# EAGLE board M865B (EAGLE 6.6.0), part 1 of 2
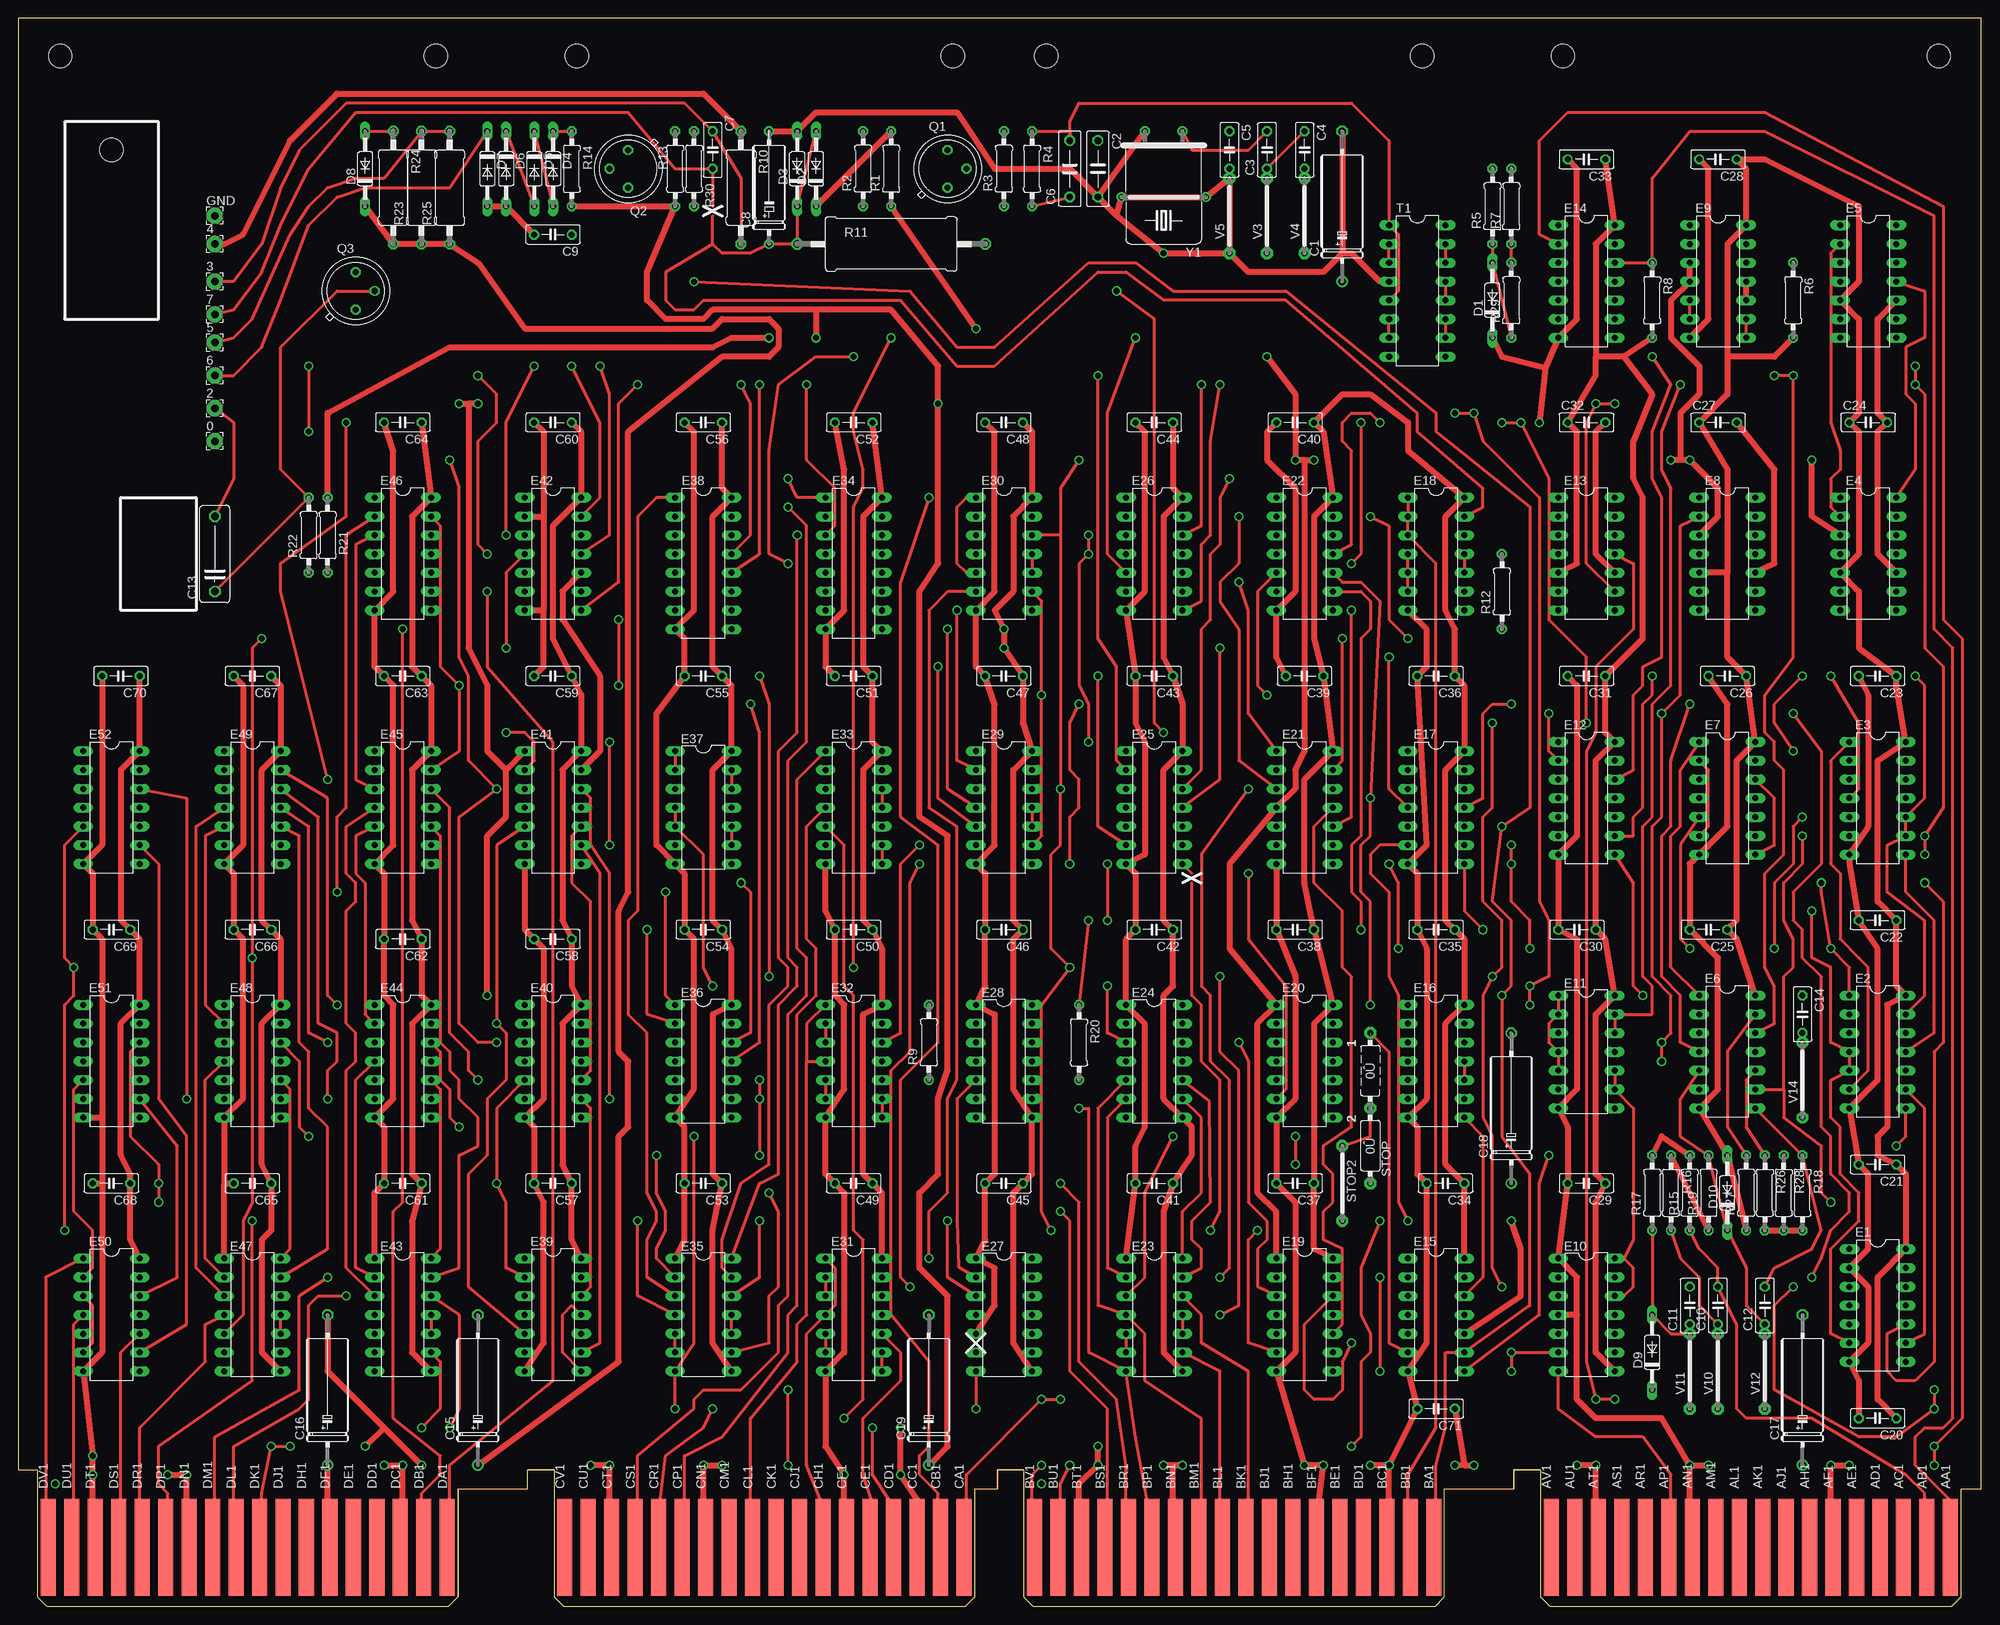
[diagram p2: board, top side]
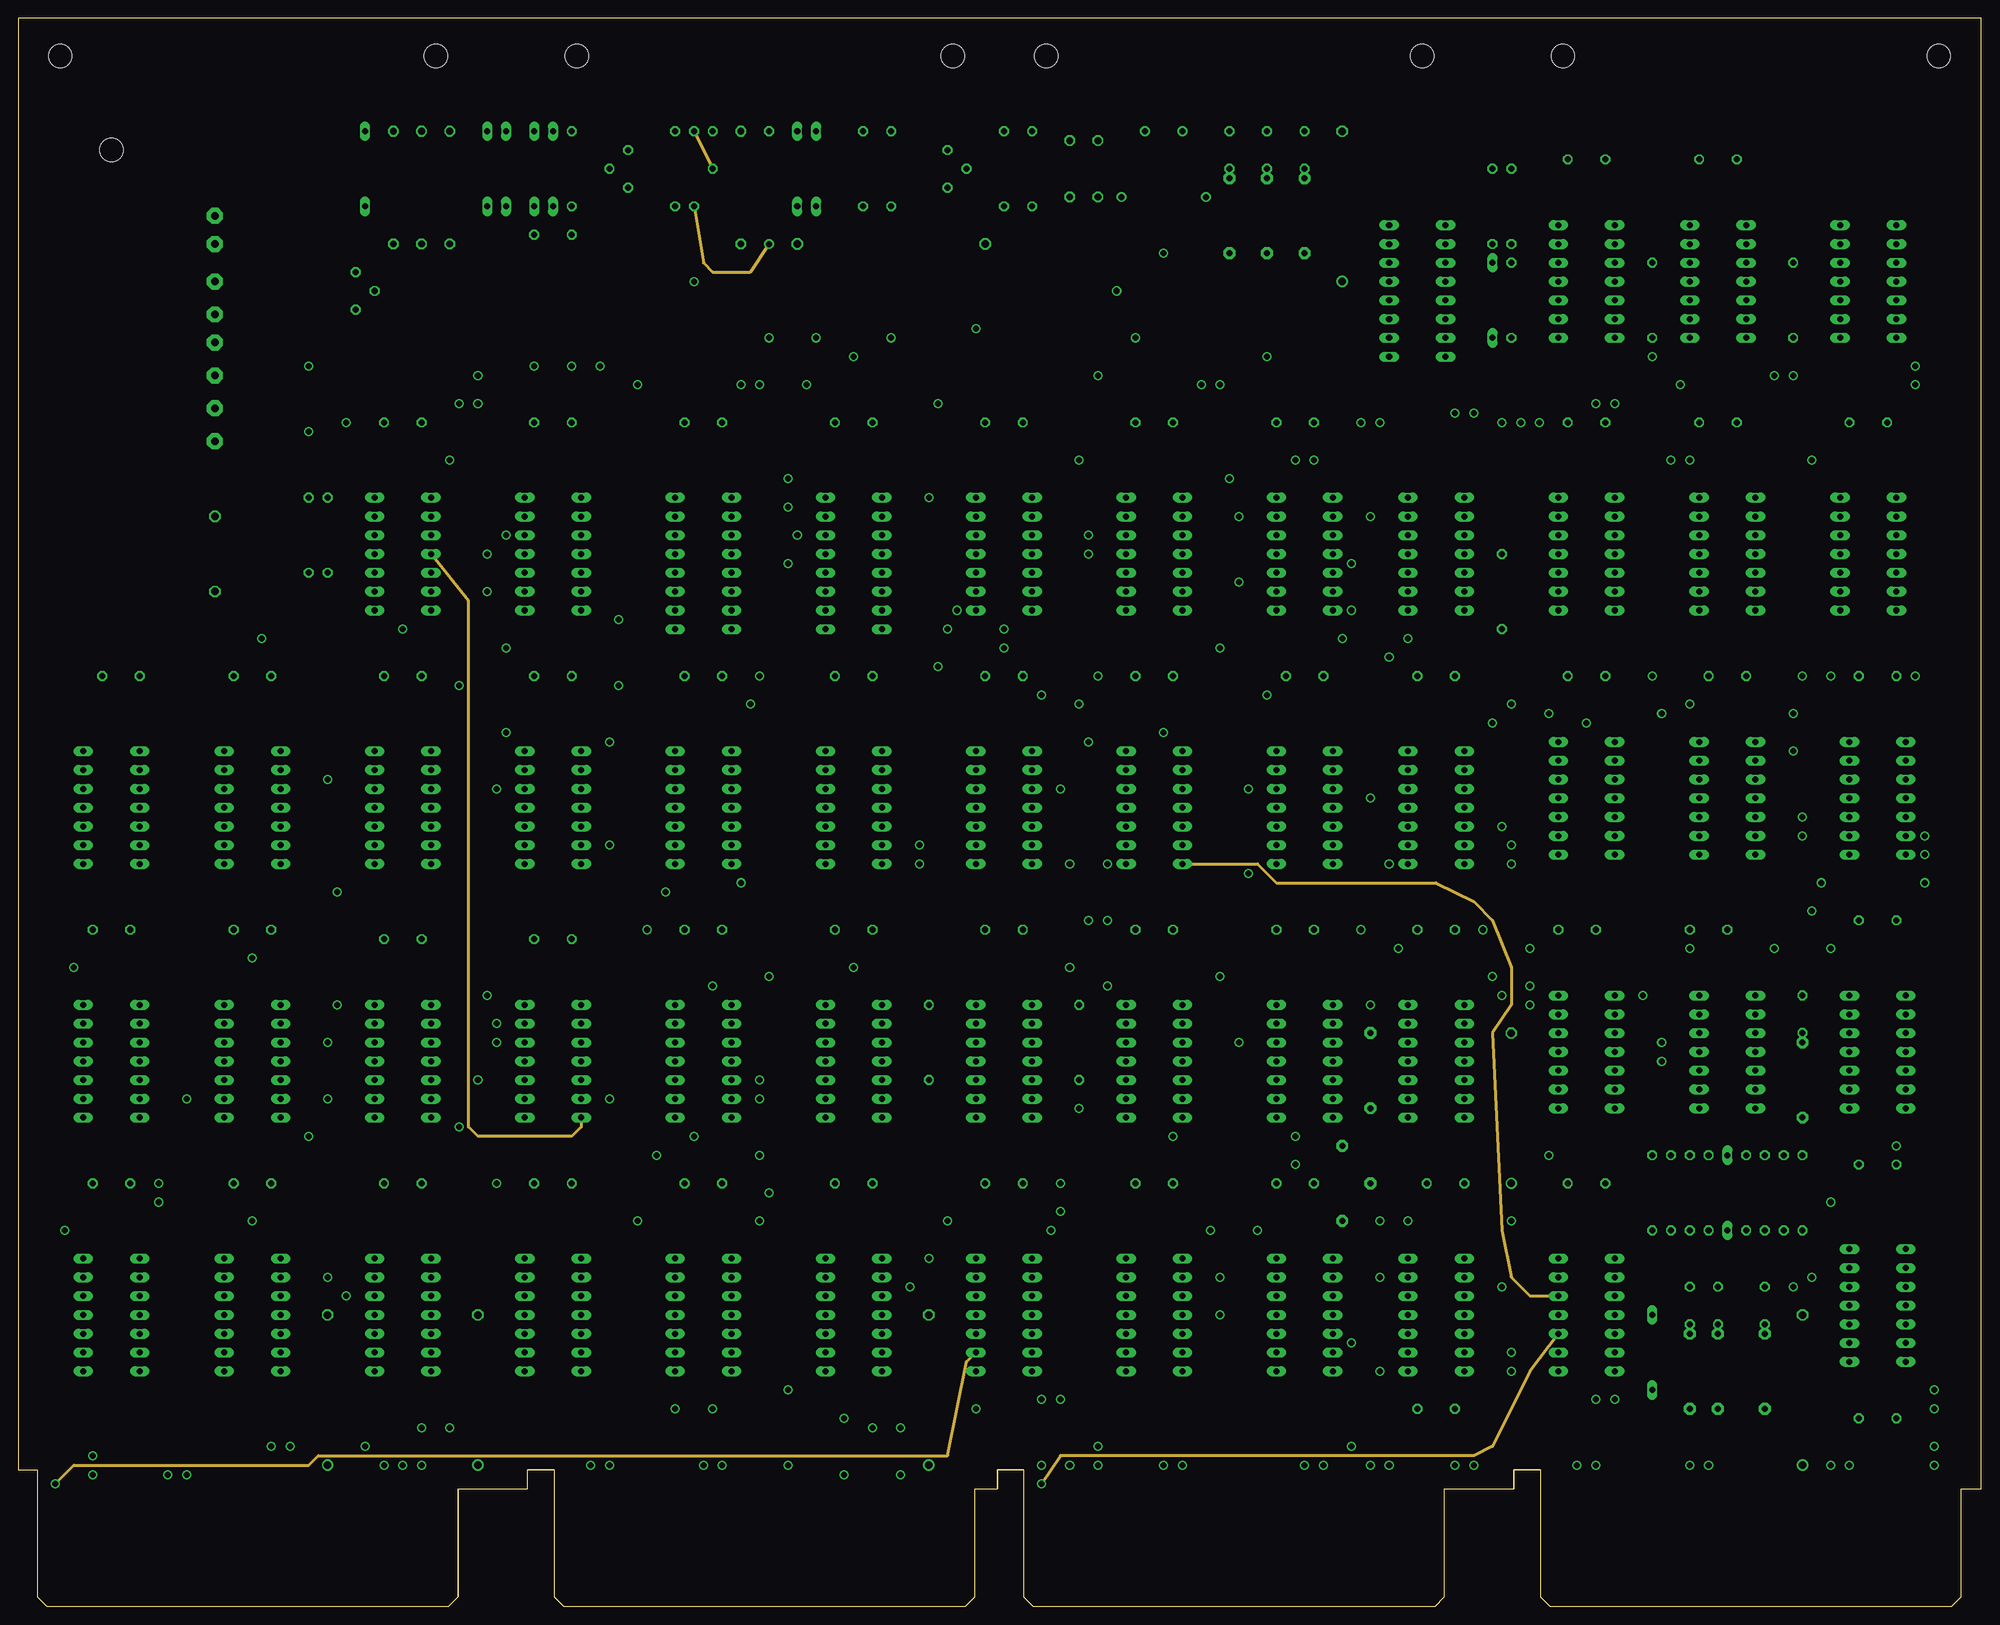
[diagram p3: board, inner layer ECO1]
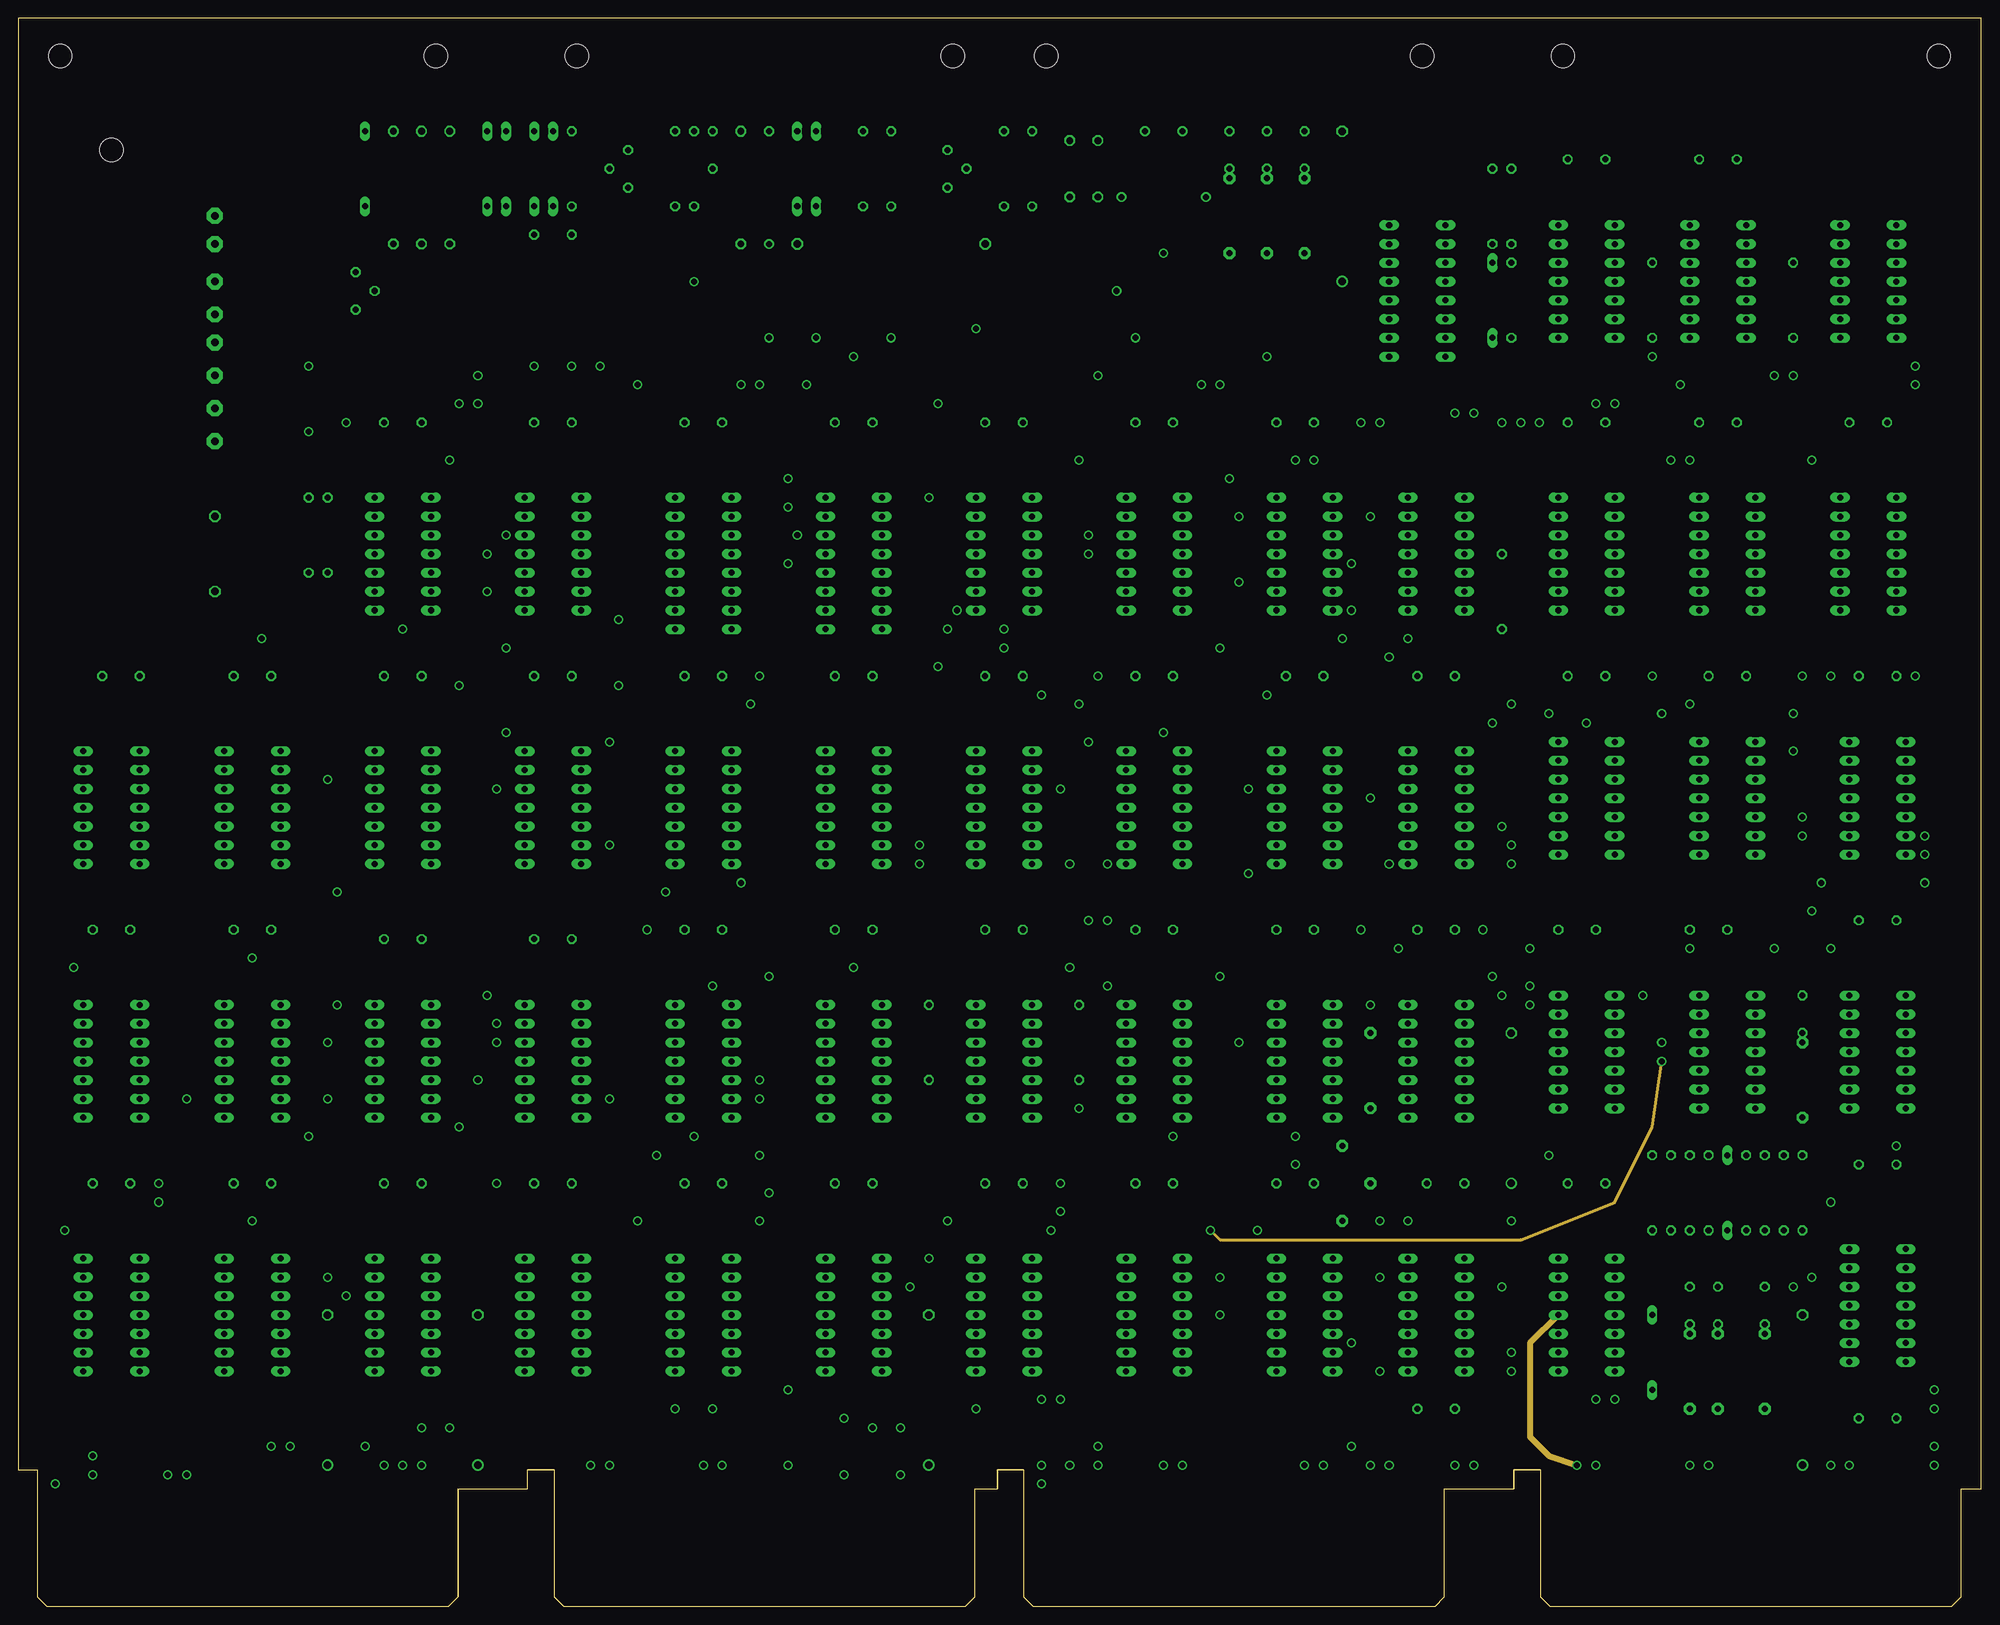
[diagram p4: board, inner layer ECO2]
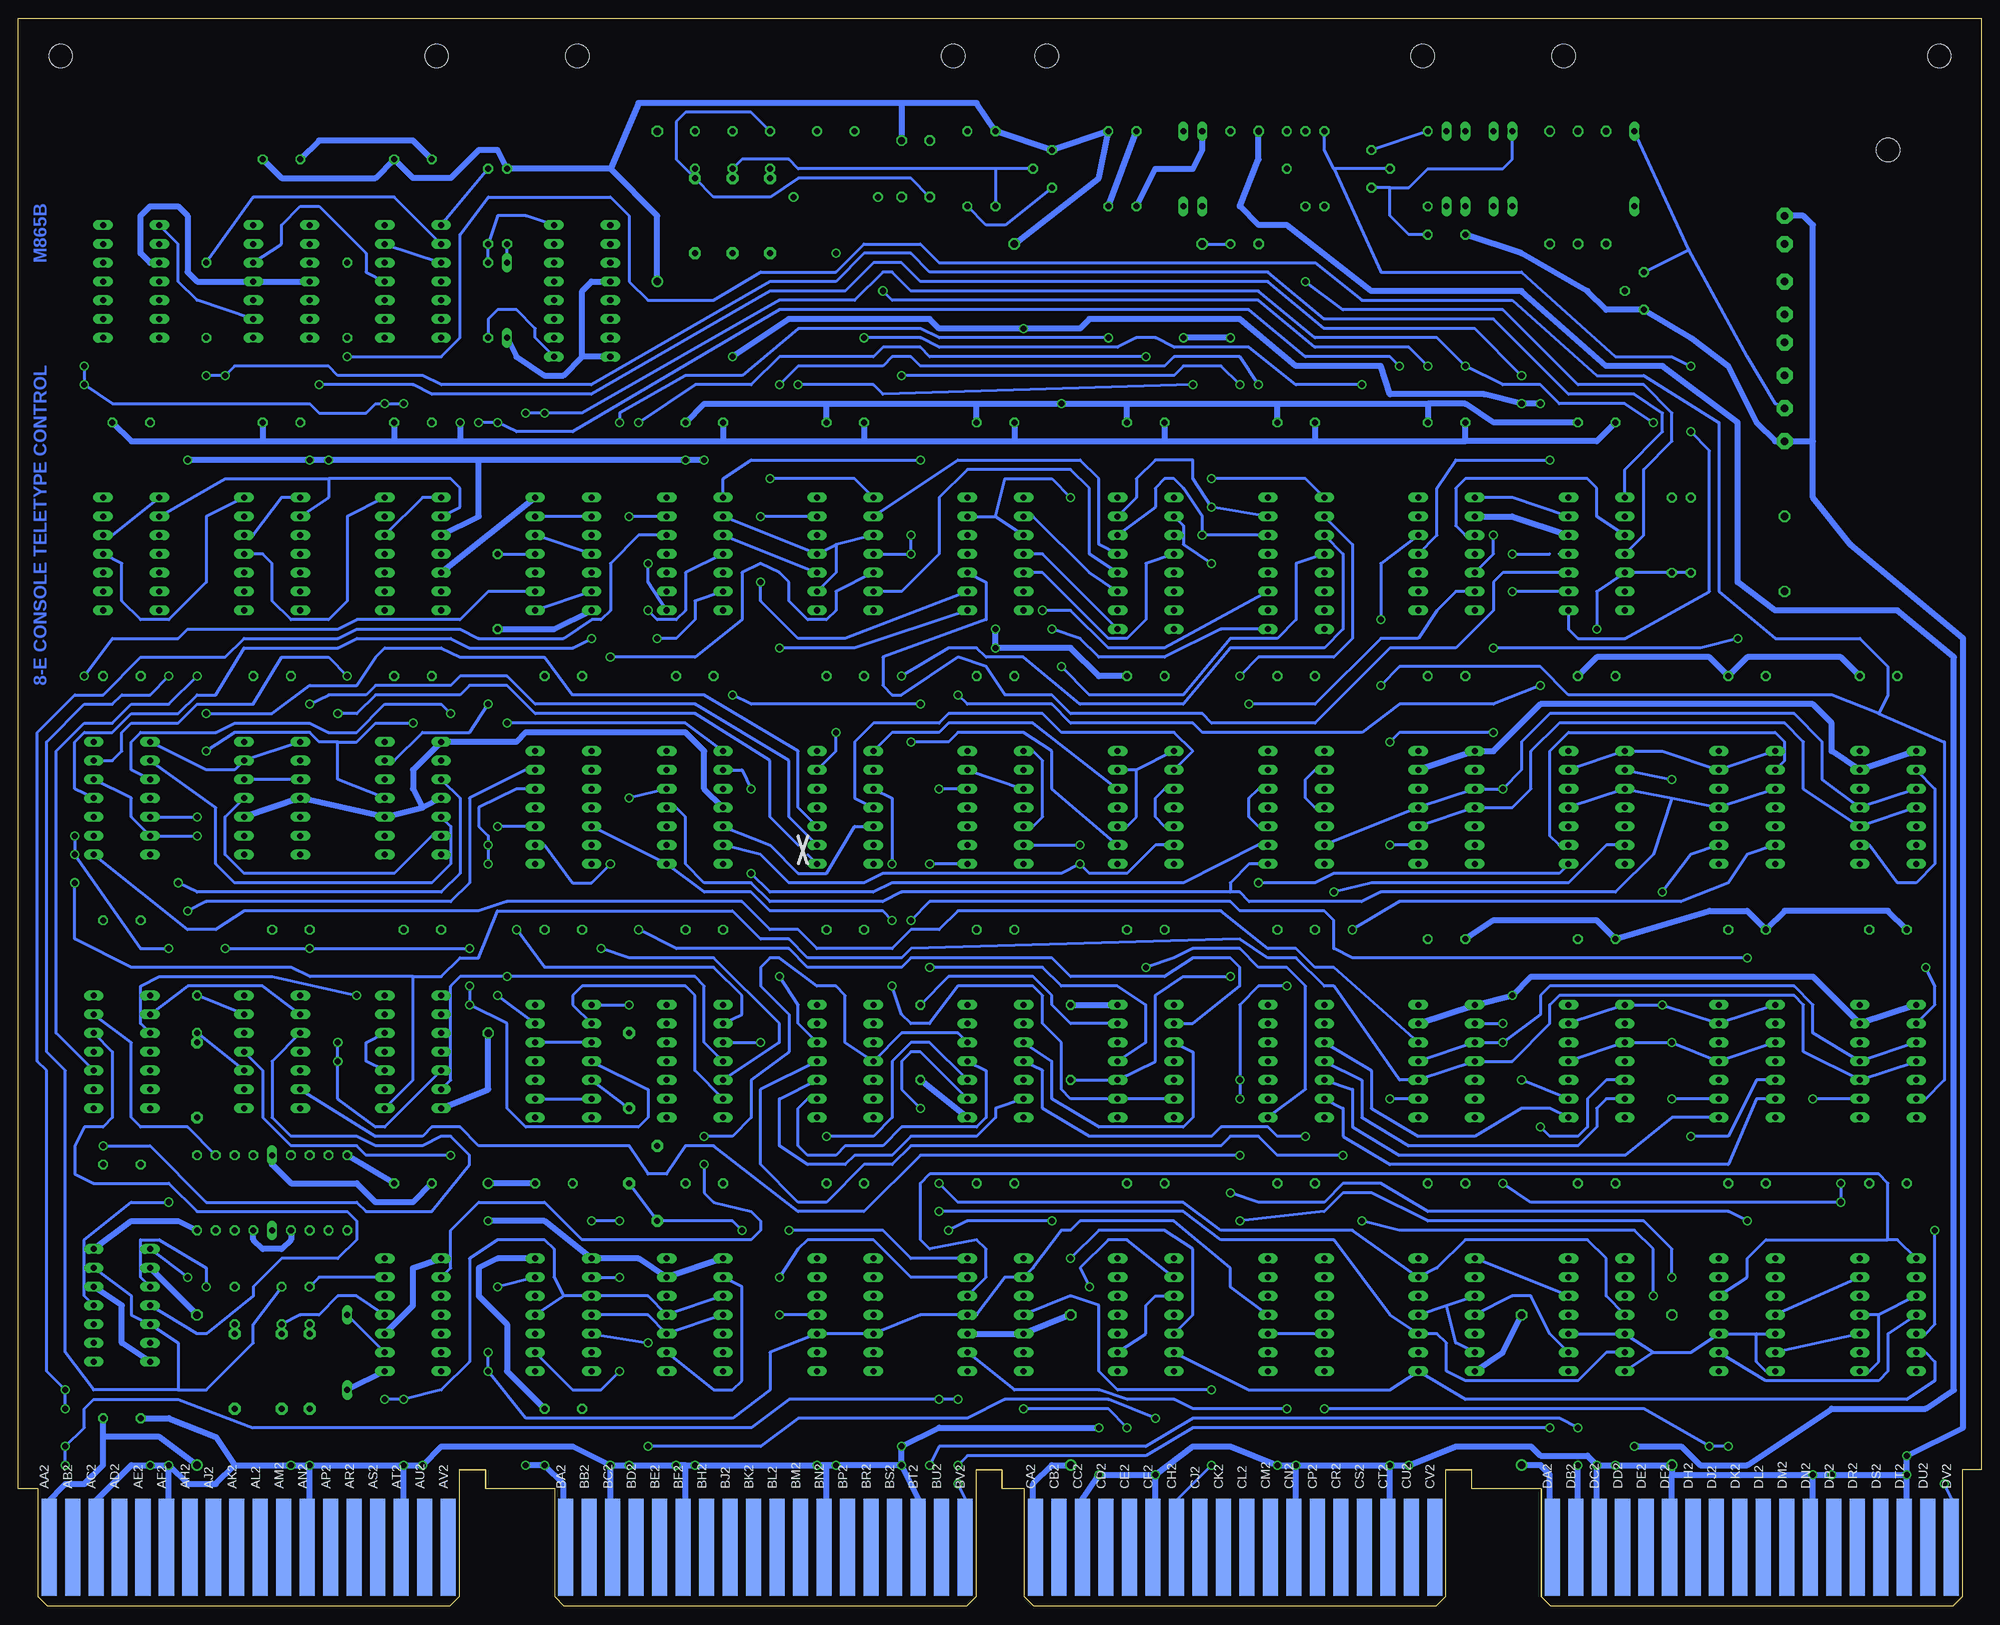
[diagram p5: board, bottom side, seen from below]

Size 265.3 x 214.63 mm. Coordinates in mm from the lower left corner, seen from the top.
Copper layers (1+2+15+16): Top 0.035mm / dielectric 1.5mm / ECO1 0.035mm / dielectric 0.15mm / ECO2 0.035mm / dielectric 0.2mm / Bottom 0.035mm
Design rules "16mils *": minimum track width 16mil, minimum drill 32mil, track to track 15mil, track to pad 10mil, pad to pad 10mil, via to via 10mil, smd to smd 10mil, copper to edge 13mil, drill to drill 10mil, minimum pad ring 10mil, minimum via ring 8mil, stop-mask expansion 0mil, vias tented up to drill 0mil, thermal gap 10mil
Net classes: 1 Supply: width 0.813 mm
Holes 3.17 mm at 12.57,196.85

## Footprints (pad centres in the part's own frame; a part is rotated, then mirrored left to right if it is on the bottom)
2,15/1,0 = drill 1.016 pad 2.159 octagon: 1 0,0
E12-8 = drill 1.016: + -10.16,0 | drill 1.016 octagon: - 10.16,0
C075-032X103 = drill 0.914 octagon: 1 -3.81,0; 2 3.81,0
C050-025X075 = drill 0.813 octagon: 1 -2.54,0; 2 2.54,0
E15-5 = drill 0.813: + -7.62,0 | drill 0.813 octagon: - 7.62,0
C102-043X133 = drill 1.016 octagon: 1 -5.08,0; 2 5.08,0
DO35-10 = drill 0.813 long: A 5.08,0; C -5.08,0
DIL14 = drill 0.813 long: 1 -7.62,-3.81; 2 -5.08,-3.81; 3 -2.54,-3.81; 4 0,-3.81; 5 2.54,-3.81; 6 5.08,-3.81; 7 7.62,-3.81; 8 7.62,3.81; 9 5.08,3.81; 10 2.54,3.81; 11 0,3.81; 12 -2.54,3.81; 13 -5.08,3.81; 14 -7.62,3.81
DIL16 = drill 0.813 long: 1 -8.89,-3.81; 2 -6.35,-3.81; 3 -3.81,-3.81; 4 -1.27,-3.81; 5 1.27,-3.81; 6 3.81,-3.81; 7 6.35,-3.81; 8 8.89,-3.81; 9 8.89,3.81; 10 6.35,3.81; 11 3.81,3.81; 12 1.27,3.81; 13 -1.27,3.81; 14 -3.81,3.81; 15 -6.35,3.81; 16 -8.89,3.81
TO5 = drill 0.813 octagon: 1 0,-2.54; 2 2.54,0; 3 0,2.54
0207/10 = drill 0.813 octagon: 1 -5.08,0; 2 5.08,0
0411/15 = drill 0.914 octagon: 1 -7.62,0; 2 7.62,0
0818/25 = drill 1.016 octagon: 1 -12.7,0; 2 12.7,0
0R2/10 = drill 0.813 pad 1.6 octagon: 1 -5.08,0; 2 5.08,0; 3 15.24,0
10 = drill 0.813 pad 1.6 octagon: 1 -5.08,0; 2 5.08,0
EDGE-CON8 = smd 2.032 x 13.106: AA1 261.303,7.938; AB1 258.127,7.938; AC1 254.952,7.938; AD1 251.778,7.938; AE1 248.602,7.938; AF1 245.428,7.938; AH1 242.252,7.938; AJ1 239.077,7.938; AK1 235.903,7.938; AL1 232.727,7.938; AM1 229.553,7.938; AN1 226.377,7.938; AP1 223.202,7.938; AR1 220.028,7.938; AS1 216.852,7.938; AT1 213.678,7.938; AU1 210.502,7.938; AV1 207.327,7.938; BA1 191.452,7.938; BB1 188.278,7.938; BC1 185.102,7.938; BD1 181.928,7.938; BE1 178.752,7.938; BF1 175.577,7.938; BH1 172.403,7.938; BJ1 169.227,7.938; BK1 166.053,7.938; BL1 162.877,7.938; BM1 159.702,7.938; BN1 156.528,7.938; BP1 153.352,7.938; BR1 150.178,7.938; BS1 147.002,7.938; BT1 143.827,7.938; BU1 140.653,7.938; BV1 137.477,7.938; CA1 127.953,7.938; CB1 124.778,7.938; CC1 121.603,7.938; CD1 118.427,7.938; CE1 115.252,7.938; CF1 112.078,7.938; CH1 108.903,7.938; CJ1 105.728,7.938; CK1 102.552,7.938; CL1 99.377,7.938; CM1 96.203,7.938; CN1 93.028,7.938; CP1 89.853,7.938; CR1 86.677,7.938; CS1 83.502,7.938; CT1 80.328,7.938; CU1 77.153,7.938; CV1 73.978,7.938; DA1 58.102,7.938; DB1 54.928,7.938; DC1 51.752,7.938; DD1 48.578,7.938; DE1 45.403,7.938; DF1 42.227,7.938; DH1 39.053,7.938; DJ1 35.877,7.938; DK1 32.703,7.938; DL1 29.527,7.938; DM1 26.352,7.938; DN1 23.177,7.938; DP1 20.003,7.938; DR1 16.828,7.938; DS1 13.652,7.938; DT1 10.477,7.938; DU1 7.303,7.938; DV1 4.128,7.938 | smd 2.032 x 13.106 bottom: AA2 261.303,7.938; AB2 258.127,7.938; AC2 254.952,7.938; AD2 251.778,7.938; AE2 248.602,7.938; AF2 245.428,7.938; AH2 242.252,7.938; AJ2 239.077,7.938; AK2 235.903,7.938; AL2 232.727,7.938; AM2 229.553,7.938; AN2 226.377,7.938; AP2 223.202,7.938; AR2 220.028,7.938; AS2 216.852,7.938; AT2 213.678,7.938; AU2 210.502,7.938; AV2 207.327,7.938; BA2 191.452,7.938; BB2 188.278,7.938; BC2 185.102,7.938; BD2 181.928,7.938; BE2 178.752,7.938; BF2 175.577,7.938; BH2 172.403,7.938; BJ2 169.227,7.938; BK2 166.053,7.938; BL2 162.877,7.938; BM2 159.702,7.938; BN2 156.528,7.938; BP2 153.352,7.938; BR2 150.178,7.938; BS2 147.002,7.938; BT2 143.827,7.938; BU2 140.653,7.938; BV2 137.477,7.938; CA2 127.953,7.938; CB2 124.778,7.938; CC2 121.603,7.938; CD2 118.427,7.938; CE2 115.252,7.938; CF2 112.078,7.938; CH2 108.903,7.938; CJ2 105.728,7.938; CK2 102.552,7.938; CL2 99.377,7.938; CM2 96.203,7.938; CN2 93.028,7.938; CP2 89.853,7.938; CR2 86.677,7.938; CS2 83.502,7.938; CT2 80.328,7.938; CU2 77.153,7.938; CV2 73.978,7.938; DA2 58.102,7.938; DB2 54.928,7.938; DC2 51.752,7.938; DD2 48.578,7.938; DE2 45.403,7.938; DF2 42.227,7.938; DH2 39.053,7.938; DJ2 35.877,7.938; DK2 32.703,7.938; DL2 29.527,7.938; DM2 26.352,7.938; DN2 23.177,7.938; DP2 20.003,7.938; DR2 16.828,7.938; DS2 13.652,7.938; DT2 10.477,7.938; DU2 7.303,7.938; DV2 4.128,7.938
OMNIBUS = hole 3.175: 208.915,209.55; 259.715,209.55; 189.865,209.55; 139.065,209.55; 75.616,209.55; 126.416,209.55; 56.566,209.55; 5.766,209.55
HC18U-H = drill 0.813: 1 -2.54,-5.08; 2 2.54,-5.08; M -5.715,3.81; M1 5.715,3.81

## Placement (x,y rotation side)
0  [2,15/1,0]  26.54,157.48 0 top
2  [2,15/1,0]  26.54,161.93 0 top
3  [2,15/1,0]  26.54,179.07 0 top
4  [2,15/1,0]  26.54,184.15 0 top
5  [2,15/1,0]  26.54,170.81 0 top
6  [2,15/1,0]  26.54,166.37 0 top
7  [2,15/1,0]  26.54,174.62 0 top
C1  6.8uF  [E12-8]  178.94,189.23 90 top
C2  .047uF  [C075-032X103]  145.92,194.31 270 top
C3  33pF  [C050-025X075]  168.78,196.85 90 top
C4  100pF  [C050-025X075]  173.86,196.85 270 top
C5  68pF  [C050-025X075]  163.7,196.85 270 top
C6  .047uF  [C075-032X103]  142.11,194.31 90 top
C7  .01uF  [C050-025X075]  93.85,196.85 90 top
C8  1uF  [E15-5]  101.47,191.77 90 top
C9  .01uF  [C050-025X075]  72.26,185.42 180 top
C10  56pF  [C050-025X075]  229.74,40.64 90 top
C11  330pF  [C050-025X075]  225.93,40.64 90 top
C12  330pF  [C050-025X075]  236.09,40.64 90 top
C13  3300pF  [C102-043X133]  26.54,142.24 90 top
C14  330pF  [C050-025X075]  241.17,80.01 270 top
C15  6.8uF  [E12-8]  62.1,29.21 90 top
C16  6.8uF  [E12-8]  41.78,29.21 90 top
C17  6.8uF  [E12-8]  241.17,29.21 90 top
C18  6.8uF  [E12-8]  201.8,67.31 90 top
C19  6.8uF  [E12-8]  123.06,29.21 90 top
C20  .01uF  [C050-025X075]  251.33,25.4 180 top
C21  .01uF  [C050-025X075]  251.33,59.69 180 top
C22  .01uF  [C050-025X075]  251.33,92.71 180 top
C23  .01uF  [C050-025X075]  251.33,125.73 180 top
C24  .01uF  [C050-025X075]  250.06,160.02 0 top
C25  .01uF  [C050-025X075]  228.47,91.44 180 top
C26  .01uF  [C050-025X075]  231.01,125.73 180 top
C27  .01uF  [C050-025X075]  229.74,160.02 0 top
C28  .01uF  [C050-025X075]  229.74,195.58 180 top
C29  .01uF  [C050-025X075]  211.96,57.15 180 top
C30  .01uF  [C050-025X075]  210.69,91.44 180 top
C31  .01uF  [C050-025X075]  211.96,125.73 180 top
C32  .01uF  [C050-025X075]  211.96,160.02 0 top
C33  .01uF  [C050-025X075]  211.96,195.58 180 top
C34  .01uF  [C050-025X075]  192.91,57.15 180 top
C35  .01uF  [C050-025X075]  191.64,91.44 180 top
C36  .01uF  [C050-025X075]  191.64,125.73 180 top
C37  .01uF  [C050-025X075]  172.59,57.15 180 top
C38  .01uF  [C050-025X075]  172.59,91.44 180 top
C39  .01uF  [C050-025X075]  173.86,125.73 180 top
C40  .01uF  [C050-025X075]  172.59,160.02 180 top
C41  .01uF  [C050-025X075]  153.54,57.15 180 top
C42  .01uF  [C050-025X075]  153.54,91.44 180 top
C43  .01uF  [C050-025X075]  153.54,125.73 180 top
C44  .01uF  [C050-025X075]  153.54,160.02 180 top
C45  .01uF  [C050-025X075]  133.22,57.15 180 top
C46  .01uF  [C050-025X075]  133.22,91.44 180 top
C47  .01uF  [C050-025X075]  133.22,125.73 180 top
C48  .01uF  [C050-025X075]  133.22,160.02 180 top
C49  .01uF  [C050-025X075]  112.9,57.15 180 top
C50  .01uF  [C050-025X075]  112.9,91.44 180 top
C51  .01uF  [C050-025X075]  112.9,125.73 180 top
C52  .01uF  [C050-025X075]  112.9,160.02 180 top
C53  .01uF  [C050-025X075]  92.58,57.15 180 top
C54  .01uF  [C050-025X075]  92.58,91.44 180 top
C55  .01uF  [C050-025X075]  92.58,125.73 180 top
C56  .01uF  [C050-025X075]  92.58,160.02 180 top
C57  .01uF  [C050-025X075]  72.26,57.15 180 top
C58  .01uF  [C050-025X075]  72.26,90.17 180 top
C59  .01uF  [C050-025X075]  72.26,125.73 180 top
C60  .01uF  [C050-025X075]  72.26,160.02 180 top
C61  .01uF  [C050-025X075]  51.94,57.15 180 top
C62  .01uF  [C050-025X075]  51.94,90.17 180 top
C63  .01uF  [C050-025X075]  51.94,125.73 180 top
C64  .01uF  [C050-025X075]  51.94,160.02 180 top
C65  .01uF  [C050-025X075]  31.62,57.15 180 top
C66  .01uF  [C050-025X075]  31.62,91.44 180 top
C67  .01uF  [C050-025X075]  31.62,125.73 180 top
C68  .01uF  [C050-025X075]  12.57,57.15 180 top
C69  .01uF  [C050-025X075]  12.57,91.44 180 top
C70  .01uF  [C050-025X075]  13.84,125.73 180 top
C71  .01uF  [C050-025X075]  191.64,26.67 180 top
D1  D662  [DO35-10]  199.26,176.53 90 top
D2  D664  [DO35-10]  107.82,194.31 90 top
D3  D664  [DO35-10]  105.28,194.31 90 top
D4  D664  [DO35-10]  72.26,194.31 270 top
D5  D664  [DO35-10]  69.72,194.31 270 top
D6  D664  [DO35-10]  65.91,194.31 270 top
D7  D664  [DO35-10]  63.37,194.31 270 top
D8  D664  [DO35-10]  46.86,194.31 90 top
D9  D664  [DO35-10]  220.85,34.29 90 top
D10  D664  [DO35-10]  231.01,55.88 90 top
E1  7474N  [DIL14]  251.33,40.64 270 top
E2  7410N  [DIL14]  251.33,74.93 270 top
E3  7400N  [DIL14]  251.33,109.22 270 top
E4  74LS93N  [DIL14]  250.06,142.24 270 top
E5  74LS93N  [DIL14]  250.06,179.07 270 top
E6  7404N  [DIL14]  231.01,74.93 270 top
E7  7474N  [DIL14]  231.01,109.22 270 top
E8  74LS93N  [DIL14]  231.01,142.24 270 top
E9  74H72N  [DIL14]  229.74,179.07 270 top
E10  SP380N  [DIL14]  211.96,39.37 270 top
E11  7440N  [DIL14]  211.96,74.93 270 top
E12  7474N  [DIL14]  211.96,109.22 270 top
E13  74LS93N  [DIL14]  211.96,142.24 270 top
E14  74H00N  [DIL14]  211.96,179.07 270 top
E15  7474N  [DIL14]  191.64,39.37 270 top
E16  7400N  [DIL14]  191.64,73.66 270 top
E17  7400N  [DIL14]  191.64,107.95 270 top
E18  7460N  [DIL14]  191.64,142.24 270 top
E19  7474N  [DIL14]  173.86,39.37 270 top
E20  7474N  [DIL14]  173.86,73.66 270 top
E21  7474N  [DIL14]  173.86,107.95 270 top
E22  7404N  [DIL14]  173.86,142.24 270 top
E23  SP380N  [DIL14]  153.54,39.37 270 top
E24  SP314N  [DIL14]  153.54,73.66 270 top
E25  7402N  [DIL14]  153.54,107.95 270 top
E26  7402N  [DIL14]  153.54,142.24 270 top
E27  SP384N  [DIL14]  133.22,39.37 270 top
E28  SP314N  [DIL14]  133.22,73.66 270 top
E29  7400N  [DIL14]  133.22,107.95 270 top
E30  7400N  [DIL14]  133.22,142.24 270 top
E31  97401N  [DIL14]  112.9,39.37 270 top
E32  97401N  [DIL14]  112.9,73.66 270 top
E33  97401N  [DIL14]  112.9,107.95 270 top
E34  DEC8251  [DIL16]  112.9,140.97 270 top
E35  SP380N  [DIL14]  92.58,39.37 270 top
E36  7430N  [DIL14]  92.58,73.66 270 top
E37  7440N  [DIL14]  92.58,107.95 270 top
E38  DEC8251  [DIL16]  92.58,140.97 270 top
E39  97401N  [DIL14]  72.26,39.37 270 top
E40  7474N  [DIL14]  72.26,73.66 270 top
E41  7474N  [DIL14]  72.26,107.95 270 top
E42  7474N  [DIL14]  72.26,142.24 270 top
E43  SP384N  [DIL14]  51.94,39.37 270 top
E44  7474N  [DIL14]  51.94,73.66 270 top
E45  7474N  [DIL14]  51.94,107.95 270 top
E46  7474N  [DIL14]  51.94,142.24 270 top
E47  SP384N  [DIL14]  31.62,39.37 270 top
E48  7474N  [DIL14]  31.62,73.66 270 top
E49  7474N  [DIL14]  31.62,107.95 270 top
E50  97401N  [DIL14]  12.57,39.37 270 top
E51  7474N  [DIL14]  12.57,73.66 270 top
E52  7474N  [DIL14]  12.57,107.95 270 top
GND  [2,15/1,0]  26.54,187.96 0 top
Q1  2N3009B  [TO5]  125.6,194.31 0 top
Q2  MPS6534D  [TO5]  82.42,194.31 180 top
Q3  2N3009B  [TO5]  45.59,177.8 0 top
R1  330  [0207/10]  117.98,194.31 90 top
R2  750  [0207/10]  114.17,194.31 90 top
R3  10K  [0207/10]  133.22,194.31 90 top
R4  220  [0207/10]  137.03,194.31 270 top
R5  470  [0207/10]  199.26,189.23 90 top
R6  1.5K  [0207/10]  239.9,176.53 270 top
R7  470  [0207/10]  201.8,189.23 90 top
R8  1.5K  [0207/10]  220.85,176.53 270 top
R9  470  [0207/10]  123.06,76.2 90 top
R10  560 1/2W  [0411/15]  97.66,191.77 270 top
R11  750 2W  [0818/25]  117.98,184.15 0 top
R12  100  [0207/10]  200.53,137.16 90 top
R13  1K  [0207/10]  88.77,194.31 270 top
R14  150  [0207/10]  74.8,194.31 270 top
R15  4.7K  [0207/10]  225.93,55.88 90 top
R16  7.5K  [0207/10]  223.39,55.88 270 top
R17  1.8K  [0207/10]  220.85,55.88 90 top
R18  470  [0207/10]  241.17,55.88 270 top
R19  220  [0207/10]  228.47,55.88 90 top
R20  470  [0207/10]  143.38,76.2 270 top
R21  1.5K  [0207/10]  41.78,144.78 90 top
R22  390  [0207/10]  39.24,144.78 90 top
R23  680 1/2W  [0411/15]  54.48,191.77 90 top
R24  750 1/2W  [0411/15]  50.67,191.77 270 top
R25  680 1/2W  [0411/15]  58.29,191.77 90 top
R26  470  [0207/10]  236.09,55.88 270 top
R27  220  [0207/10]  233.55,55.88 90 top
R28  1K  [0207/10]  238.63,55.88 270 top
R29  3.3K  [0207/10]  201.8,176.53 90 top
R30  180  [0207/10]  91.31,194.31 270 top
STOP  [0R2/10]  182.75,62.23 90 top
STOP2  [10]  178.94,57.15 270 top
T1  16-09651  [DIL16]  189.1,177.8 270 top
U$1  [EDGE-CON8]  -0.13,0 0 top
U$2  OUTLINE-OMNIBUS  [OMNIBUS]  -0.13,0 0 top
V3  [10]  168.78,187.96 90 top
V4  [10]  173.86,187.96 90 top
V5  [10]  163.7,187.96 90 top
V10  [10]  229.74,31.75 90 top
V11  [10]  225.93,31.75 90 top
V12  [10]  236.09,31.75 90 top
V14  [10]  241.17,71.12 90 top
Y1  14.418MHz  [HC18U-H]  154.81,194.31 180 top

## Tracks (layer width: path | path; a pad name or v marks a point on that pad's centre or on a via)
603X  (via drill 0.81)
  Top 0.406: E32.2 E32.3 | E22.9 181.48,137.16 182.75,135.89 182.75,132.08 181.48,130.81 181.48,104.14 180.21,102.87 180.21,96.52 181.48,95.25 v181.48,91.44
  Bottom 0.406: E32.2 106.55,78.74 100.2,83.82 100.2,86.36 101.47,87.63 106.55,87.63 110.36,85.09 123.06,85.09 125.6,87.63 144.65,87.63 145.92,86.36 158.62,86.36 161.16,88.9 176.4,88.9 v181.48,91.44 | E32.3 106.55,74.93 106.55,66.04 107.82,64.77 119.25,64.77 125.6,68.58 125.6,73.66 E28.3
604X  (via drill 0.81)
  Top 0.406: E32.5 E32.6 | E32.9 E32.8 | E24.3 147.19,77.47 v147.19,83.82
  Bottom 0.406: E32.6 E32.9 123.06,68.58 124.33,69.85 124.33,76.2 126.87,78.74 126.87,82.55 128.14,83.82 138.3,83.82 142.11,78.74 144.65,78.74 145.92,80.01 v147.19,83.82
!603  (via drill 0.81)
  Top 0.406: v104.01,140.97 101.47,142.24 101.47,156.21 102.74,165.1 107.82,168.91 v112.9,168.91 | v181.48,160.02 181.48,142.24 v180.21,140.97
  Bottom 0.406: E34.2 107.82,146.05 107.82,143.51 v104.01,140.97 | E22.8 180.21,138.43 v180.21,140.97 | v112.9,168.91 142.11,168.91 143.38,170.18 148.46,170.18 149.73,168.91 162.43,168.91 166.24,165.1 173.86,165.1 v181.48,160.02
!604  (via drill 0.81)
  Top 0.406: v100.2,125.73 101.47,121.92 v101.47,85.09
  Bottom 0.406: E38.2 84.96,143.51 84.96,130.81 87.5,128.27 97.66,128.27 v100.2,125.73 | R9.1 E32.10 111.63,73.66 111.63,82.55 107.82,85.09 v101.47,85.09
!C0
  Top 0.406: U$1.CE1 115.44,8.89 115.44,13.97 114.17,17.78 114.17,25.4 119.25,30.48 119.25,34.29 E31.10
!C1
  Top 0.406: U$1.CH1 109.09,8.89 109.09,12.7 106.55,19.05 106.55,36.83 E31.4 110.36,40.64 110.36,45.72 E31.1
!CLR_ACTIVE  (via drill 0.81)
  Top 0.406: v242.44,44.45 243.71,46.99 244.98,50.8 247.52,53.34 247.52,55.88 244.98,58.42 244.98,63.5 243.71,64.77 243.71,85.09 241.17,87.63 241.17,91.44 239.9,92.71 239.9,96.52 243.71,100.33 243.71,115.57 v239.9,120.65
  Bottom 0.406: E1.1 v242.44,44.45 | E25.10 159.89,107.95 159.89,115.57 172.59,123.19 190.37,123.19 194.18,128.27 205.61,128.27 208.15,129.54 215.77,129.54 217.04,128.27 219.58,124.46 225.93,124.46 231.01,120.65 v239.9,120.65
!DATA4  (via drill 0.81)
  Top 0.406: U$1.BR1 149.73,11.43 149.73,19.05 148.46,27.94 143.38,33.02 143.38,54.61 v140.84,57.15
  Bottom 0.406: E43.4 50.67,41.91 50.67,46.99 53.21,49.53 69.72,49.53 73.53,45.72 E39.13 84.96,50.8 102.74,50.8 107.82,54.61 138.3,54.61 v140.84,57.15
!DATA5  (via drill 0.81)
  Top 0.406: U$1.BS1 147.19,10.16 147.19,26.67 142.11,31.75 142.11,52.07 v140.84,53.34
  Bottom 0.406: E43.6 50.67,34.29 54.48,30.48 69.72,30.48 72.26,31.75 72.26,35.56 73.53,36.83 E39.10 79.88,39.37 87.5,49.53 102.74,49.53 107.82,53.34 v140.84,53.34
!DATA6  (via drill 0.81)
  Top 0.406: E43.9 57.02,33.02 57.02,26.67 v54.48,24.13 | U$1.BU1 140.84,10.16 140.84,16.51 v142.11,19.05
  Bottom 0.406: E43.9 58.29,36.83 60.83,41.91 63.37,41.91 E39.4 | v54.48,24.13 57.02,25.4 106.55,25.4 112.9,21.59 140.84,21.59 v142.11,19.05
!DATA7  (via drill 0.81)
  Top 0.406: U$1.BV1 137.03,10.16 137.03,13.97 137.03,17.78 v138.3,19.05 | E43.12 59.56,39.37 59.56,26.67 v58.29,24.13
  Bottom 0.406: E43.12 E39.1 | v58.29,24.13 106.55,24.13 112.9,20.32 137.03,20.32 v138.3,19.05
!DATA8
  Top 0.406: U$1.DR1 16.38,8.89 16.38,24.13 25.27,33.02 25.27,38.1 E47.4
  Bottom 0.406: E50.13 E47.4
!DATA9
  Top 0.406: U$1.DS1 13.84,8.89 13.84,34.29 E50.10
  Bottom 0.406: E50.10 E47.6
!DATA10
  Top 0.406: U$1.DU1 7.49,8.89 7.49,38.1 E50.4
  Bottom 0.406: E50.4 12.57,36.83 12.57,31.75 13.84,30.48 29.08,30.48 E47.9
!DATA11
  Top 0.406: E50.1 3.68,44.45 3.68,8.89 U$1.DV1
  Bottom 0.406: E50.1 11.3,49.53 12.57,49.53 | 12.57,49.53 12.57,57.15 13.84,58.42 142.11,58.42 143.38,57.15 143.38,49.53 142.11,48.26 135.76,49.53 134.49,48.26 134.49,44.45 E27.12 | E47.12 31.62,44.45 31.62,46.99 29.08,49.53 12.57,49.53
!DTX_ACTIVE  (via drill 0.81)
  Top 0.406: E6.12 237.36,78.74 237.36,83.82 236.09,86.36 236.09,99.06 238.63,101.6 238.63,113.03 237.36,114.3 237.36,116.84 236.09,118.11 236.09,123.19 239.9,128.27 v239.9,166.37 v237.36,166.37
  Bottom 0.406: E46.1 48.13,153.67 43.05,158.75 43.05,161.29 46.86,163.83 55.75,163.83 65.91,173.99 88.77,173.99 96.39,180.34 142.11,180.34 144.65,182.88 151,182.88 154.81,179.07 163.7,179.07 187.83,165.1 208.15,165.1 210.69,166.37 222.12,166.37 223.39,167.64 236.09,167.64 v237.36,166.37 v239.9,166.37
!ENABLE  (via drill 0.81)
  Top 0.406: E36.11 100.2,76.2 100.2,118.11 v98.93,121.92
  Bottom 0.406: E42.6 70.99,137.16 73.53,134.62 76.07,130.81 81.15,130.81 90.04,121.92 v98.93,121.92
!FREQ_DIV  (via drill 0.81)
  Top 0.406: v41.78,76.2 39.24,77.47 39.24,105.41 E49.11 | E46.3 45.59,143.51 45.59,111.76 E45.3 | E19.10 178.94,38.1 178.94,48.26 176.4,49.53 176.4,53.34 177.67,54.61 177.67,58.42 176.4,59.69 176.4,62.23 180.21,64.77 180.21,85.09 178.94,86.36 178.94,93.98 175.13,97.79 175.13,105.41 E21.11
  Bottom 0.406: E48.3 E48.11 v41.78,76.2 E44.3 E44.11 | E49.3 E49.11 41.78,109.22 | 41.78,109.22 E45.3 E45.11 | 41.78,109.22 44.32,101.6 49.4,96.52 81.15,96.52 83.69,95.25 98.93,95.25 100.2,96.52 101.47,96.52 | E46.3 51.94,147.32 51.94,151.13 53.21,152.4 69.72,152.4 70.99,151.13 70.99,146.05 69.72,144.78 E42.3 | E19.4 E19.10 180.21,39.37 E15.4 | 101.47,96.52 145.92,96.52 148.46,95.25 163.7,95.25 166.24,97.79 172.59,97.79 175.13,100.33 175.13,106.68 176.4,107.95 E21.11 | E37.8 98.93,100.33 101.47,97.79 101.47,96.52
!INITIALIZE  (via drill 0.81)
  Top 0.406: v43.05,81.28 41.78,82.55 41.78,109.22 E49.13 | E46.13 57.02,146.05 57.02,127 v59.56,124.46 59.56,115.57 E45.13 | v199.26,119.38 199.26,107.95 197.99,106.68 197.99,95.25 200.53,92.71 200.53,86.36 v199.26,85.09 197.99,82.55 197.99,66.04 199.26,63.5 199.26,45.72 v200.53,43.18 | E29.9 138.3,104.14 v138.3,123.19 138.3,135.89 E30.9 | E21.1 166.24,120.65 166.24,134.62 v164.97,138.43
  Bottom 0.406: E48.1 E48.13 v43.05,81.28 E44.1 E44.13 | E49.1 E49.13 43.05,115.57 E45.1 E45.13 | E46.13 63.37,149.86 E42.1 | E15.13 v200.53,43.18 | E20.4 172.59,76.2 172.59,83.82 173.86,85.09 v199.26,85.09 205.61,85.09 206.88,83.82 206.88,71.12 E11.6 | E21.1 175.13,119.38 v199.26,119.38 | E30.9 153.54,130.81 159.89,130.81 164.97,135.89 v164.97,138.43 | v59.56,124.46 65.91,121.92 78.61,121.92 83.69,118.11 105.28,118.11 106.55,119.38 123.06,119.38 125.6,121.92 137.03,121.92 v138.3,123.19
!INT_ENA
  Bottom 0.406: E21.5 163.7,102.87 159.89,99.06 156.08,99.06 152.27,105.41 E25.5
!INT_RQST
  Top 0.406: U$1.CP1 90.04,8.89 90.04,20.32 95.12,22.86 104.01,34.29 104.01,39.37 105.28,40.64 105.28,80.01 107.82,82.55 107.82,88.9 106.55,90.17 106.55,105.41 E33.4
!INTERNAL_IO
  Top 0.406: E32.1 106.55,78.74 106.55,73.66 | 106.55,73.66 E32.4 | U$1.CL1 98.93,8.89 98.93,25.4 105.28,33.02 105.28,38.1 106.55,39.37 106.55,73.66
!IO_PAUSE  (via drill 0.81)
  Top 0.406: E27.7 v129.41,26.67 | U$1.CD1 117.98,8.89 117.98,13.97 115.44,17.78 v115.44,24.13
  Bottom 0.406: v115.44,24.13 117.98,26.67 v129.41,26.67
!KCC
  Bottom 0.406: E34.11 120.52,139.7 128.14,147.32 E30.2
!KCF
  Bottom 0.406: E34.13 119.25,143.51 119.25,152.4 121.79,154.94 138.3,154.94 E26.2
!KIE  (via drill 0.81)
  Top 0.406: E26.12 159.89,146.05 v159.89,165.1 | E34.3 110.36,146.05 110.36,151.13 106.55,154.94 v106.55,165.1
  Bottom 0.406: v106.55,165.1 148.46,163.83 149.73,165.1 v159.89,165.1
!KRB
  Top 0.406: E30.5 128.14,139.7 126.87,140.97 126.87,148.59 128.14,149.86 E30.1
  Bottom 0.406: E34.4 112.9,140.97 112.9,133.35 115.44,130.81 117.98,130.81 126.87,139.7 E30.5
!KRS
  Bottom 0.406: E34.9 126.87,142.24 E30.4
!KSF
  Bottom 0.406: E34.12 120.52,142.24 120.52,151.13 123.06,153.67 137.03,153.67 140.84,149.86 140.84,142.24 145.92,137.16 E26.6
!LAST_UNIT  (via drill 0.81)
  Top 0.406: v219.58,82.55 218.31,83.82 218.31,97.79 E12.8
  Bottom 0.406: E2.3 248.79,78.74 248.79,83.82 246.25,85.09 231.01,85.09 v219.58,82.55
!MD3
  Top 0.406: U$1.AP1 223.39,10.16 223.39,17.78 219.58,22.86 213.23,22.86 208.15,26.67 E10.7
!MD4
  Top 0.406: U$1.BK1 166.24,8.89 166.24,31.75 159.89,35.56 159.89,39.37 E23.12
!MD5
  Top 0.406: U$1.BL1 162.43,10.16 162.43,31.75 E23.9
!MD6
  Top 0.406: U$1.BM1 159.89,10.16 159.89,25.4 152.27,30.48 152.27,36.83 E23.4 145.92,40.64 145.92,67.31 E24.5
!MD7  (via drill 0.81)
  Top 0.406: U$1.BP1 153.54,8.89 151,22.86 E23.7 144.65,34.29 144.65,67.31 v143.38,67.31
  Bottom 0.406: E28.9 143.38,74.93 144.65,74.93 145.92,73.66 145.92,69.85 v143.38,67.31
!MD8  (via drill 0.81)
  Top 0.406: U$1.DK1 32.89,8.89 32.89,15.24 v34.16,21.59 v36.7,21.59 | v88.77,26.67 E35.7 91.31,35.56 v91.31,63.5
  Bottom 0.406: v91.31,63.5 95.12,63.5 96.39,64.77 102.74,64.77 104.01,63.5 120.52,63.5 126.87,67.31 126.87,72.39 E28.4 | v34.16,21.59 v36.7,21.59 45.59,26.67 v88.77,26.67
!MD9  (via drill 0.81)
  Top 0.406: U$1.DL1 29.08,8.89 29.08,21.59 37.97,26.67 39.24,27.94 39.24,40.64 40.51,41.91 v44.32,41.91 | E35.4 83.69,41.91 v83.69,52.07
  Bottom 0.406: v44.32,41.91 44.32,48.26 46.86,50.8 78.61,50.8 v83.69,52.07
!MD10  (via drill 0.81)
  Top 0.406: U$1.DM1 26.54,7.62 26.54,22.86 37.97,29.21 37.97,41.91 v41.78,44.45 | E35.12 100.2,44.45 v100.2,52.07
  Bottom 0.406: v41.78,44.45 41.78,48.26 45.59,52.07 74.8,52.07 82.42,55.88 86.23,55.88 88.77,53.34 v100.2,52.07
!MD11  (via drill 0.81)
  Top 0.406: U$1.DP1 20.19,8.89 20.19,15.24 18.92,16.51 18.92,21.59 31.62,30.48 v31.62,52.07 | E35.9 101.47,35.56 101.47,41.91 102.74,43.18 102.74,53.34 v101.47,55.88
  Bottom 0.406: v31.62,52.07 34.16,53.34 74.8,53.34 81.15,57.15 86.23,57.15 88.77,54.61 97.66,54.61 v101.47,55.88
!POWER_OK
  Top 0.406: E25.8 158.62,99.06
  ECO1 0.406: E25.8 167.51,100.33 170.05,97.79 191.64,97.79 196.72,95.25 199.26,92.71 201.8,86.36 201.8,81.28 199.26,77.47 200.53,50.8 201.8,44.45 204.34,41.91 E10.3
  Bottom 0.406: E25.8 158.62,101.6
!PRESET
  Top 0.406: E3.1 244.98,114.3 244.98,100.33 246.25,99.06 246.25,90.17 248.79,87.63 250.06,86.36 250.06,72.39 E2.6 | E6.1 223.39,86.36 223.39,104.14 224.66,105.41 224.66,113.03 E7.1
  Bottom 0.406: E7.1 E7.13 236.09,113.03 239.9,113.03 E3.1
!RX_ACTIVE  (via drill 0.81)
  Top 0.406: E1.6 244.98,36.83 244.98,48.26 248.79,52.07 248.79,55.88 246.25,58.42 246.25,64.77 244.98,66.04 244.98,71.12 E2.5 E2.4 244.98,76.2 244.98,86.36 242.44,87.63 v242.44,93.98
  Bottom 0.406: E17.13 196.72,113.03 204.34,109.22 204.34,97.79 206.88,95.25 239.9,95.25 v242.44,93.98
!RX_CLK  (via drill 0.81)
  Top 0.406: E6.9 238.63,69.85 | 238.63,69.85 238.63,85.09 239.9,86.36 239.9,90.17 238.63,92.71 238.63,97.79 241.17,100.33 v241.17,104.14 | v244.98,54.61 243.71,55.88 243.71,62.23 238.63,66.04 238.63,69.85
  Bottom 0.406: E1.11 256.41,41.91 256.41,49.53 250.06,54.61 v244.98,54.61 | v241.17,104.14 E3.6 250.06,106.68 250.06,109.22 E3.12
!RX_CLR  (via drill 0.81)
  Top 0.406: E40.10 77.34,72.39 77.34,95.25 74.8,97.79 74.8,104.14 E41.10 | v257.68,97.79 260.22,95.25 260.22,76.2 258.95,74.93 258.95,33.02 256.41,30.48 253.87,30.48 252.6,31.75 252.6,36.83 E1.10
  Bottom 0.406: E51.4 E51.10 24,74.93 24,81.28 25.27,82.55 57.02,82.55 58.29,81.28 58.29,78.74 63.37,73.66 E40.4 E40.10 78.61,71.12 87.5,83.82 88.77,83.82 92.58,87.63 96.39,87.63 100.2,90.17 144.65,88.9 145.92,87.63 158.62,87.63 161.16,90.17 164.97,90.17 168.78,93.98 200.53,93.98 203.07,87.63 205.61,87.63 208.15,85.09 211.96,85.09 | E41.10 E41.4 63.37,107.95 60.83,110.49 60.83,115.57 57.02,119.38 26.54,119.38 24,116.84 24,110.49 E52.10 E52.4 | E11.8 211.96,71.12 211.96,85.09 | 211.96,85.09 225.93,85.09 228.47,86.36 250.06,86.36 257.68,90.17 v257.68,97.79
!RX_FLAG  (via drill 0.81)
  Top 0.406: E42.8 81.15,138.43 81.15,162.56 v83.69,165.1 | E17.4 185.29,110.49 v185.29,128.27 | E26.5 147.19,142.24 147.19,161.29 v151,171.45
  Bottom 0.406: E26.5 154.81,137.16 154.81,134.62 156.08,133.35 158.62,133.35 161.16,135.89 161.16,138.43 162.43,139.7 164.97,140.97 167.51,139.7 167.51,133.35 173.86,128.27 v185.29,128.27 | v83.69,165.1 92.58,165.1 98.93,170.18 109.09,170.18 111.63,171.45 114.17,171.45 116.71,170.18 140.84,170.18 143.38,171.45 v151,171.45
!SET_RR
  Top 0.406: E30.11 E30.10
  Bottom 0.406: E46.10 64.64,139.7 65.91,138.43 65.91,134.62 70.99,129.54 79.88,129.54 90.04,119.38 104.01,119.38 105.28,120.65 123.06,120.65 125.6,123.19 131.95,123.19 134.49,127 138.3,128.27 145.92,123.19 147.19,123.19 148.46,124.46 148.46,128.27 134.49,133.35 134.49,138.43 E30.10
!SKIP
  Top 0.406: U$1.CS1 83.69,10.16 83.69,20.32 91.31,26.67 91.31,27.94 92.58,29.21 97.66,29.21 102.74,34.29 102.74,40.64 104.01,41.91 104.01,80.01 106.55,82.55 106.55,87.63 105.28,88.9 105.28,111.76 E33.1
  Bottom 0.406: E33.1 114.17,113.03 | 114.17,113.03 E33.13 | E33.10 115.44,105.41 114.17,106.68 114.17,113.03
!STOP1
  Top 0.406: STOP.3 185.29,74.93 185.29,58.42 185.29,35.56 E15.6
!STOP2  (via drill 0.81)
  Top 0.406: E19.6 166.24,35.56 166.24,49.53 v167.51,50.8
  Bottom 0.406: STOP.1 STOP2.2 168.78,52.07 v167.51,50.8
!TCF  (via drill 0.81)
  Top 0.406: E29.2 126.87,114.3 v126.87,134.62
  Bottom 0.406: E38.11 110.36,129.54 117.98,129.54 123.06,134.62 v126.87,134.62
!TFL  (via drill 0.81)
  Top 0.406: E38.13 98.93,144.78 98.93,162.56 v97.66,165.1 | E26.8 159.89,135.89 159.89,143.51 161.16,144.78 161.16,157.48 v162.43,165.1
  Bottom 0.406: v97.66,165.1 100.2,168.91 109.09,168.91 110.36,167.64 143.38,167.64 144.65,168.91 147.19,168.91 148.46,167.64 159.89,167.64 v162.43,165.1
!TFLNOW  (via drill 0.81)
  Top 0.406: E21.10 180.21,106.68 v180.21,134.62
  Bottom 0.406: E22.4 175.13,139.7 175.13,134.62 176.4,133.35 178.94,133.35 v180.21,134.62
!TLS  (via drill 0.81)
  Top 0.406: E29.5 124.33,109.22 v124.33,127
  Bottom 0.406: E38.4 92.58,140.97 92.58,133.35 95.12,130.81 101.47,130.81 107.82,123.19 120.52,123.19 v124.33,127 | E29.5 128.14,105.41 126.87,106.68 126.87,114.3 128.14,115.57 E29.1
!TP3
  Bottom 0.406: E22.2 E26.11 154.81,143.51 | E26.3 154.81,143.51 | 154.81,143.51 154.81,139.7 E26.9
!TPC  (via drill 0.81)
  Top 0.406: E29.4 125.6,110.49 v125.6,132.08
  Bottom 0.406: E38.9 102.74,132.08 110.36,128.27 119.25,128.27 121.79,130.81 v125.6,132.08
!TPCNOW  (via drill 0.81)
  Top 0.406: E43.11 E43.10 | E47.10 E47.11 | E42.4 65.91,139.7 v65.91,129.54 | v32.89,130.81 31.62,129.54 v31.62,87.63 31.62,54.61 30.35,52.07 30.35,39.37 E47.5 | v144.65,92.71 R20.1
  Bottom 0.406: E47.7 29.08,31.75 30.35,33.02 30.35,36.83 | 30.35,36.83 E47.5 | 30.35,36.83 E47.10 39.24,34.29 44.32,34.29 | 44.32,34.29 E43.5 E43.10 | E43.7 44.32,34.29 | E32.13 123.06,78.74 125.6,81.28 125.6,82.55 128.14,85.09 139.57,85.09 R20.1 | v32.89,130.81 37.97,129.54 v65.91,129.54 | v31.62,87.63 84.96,87.63 87.5,88.9 87.5,92.71 88.77,93.98 100.2,93.98 101.47,95.25 142.11,95.25 v144.65,92.71
!TSF  (via drill 0.81)
  Top 0.406: E38.12 100.2,142.24 v100.2,165.1 | E25.2 148.46,114.3 148.46,127 145.92,130.81 v145.92,166.37
  Bottom 0.406: v100.2,165.1 102.74,167.64 107.82,167.64 109.09,166.37 v145.92,166.37
!TSK  (via drill 0.81)
  Top 0.406: E25.6 145.92,105.41 v145.92,125.73
  Bottom 0.406: E38.3 86.23,142.24 86.23,132.08 88.77,129.54 101.47,129.54 107.82,121.92 121.79,121.92 129.41,128.27 134.49,128.27 135.76,129.54 139.57,129.54 v145.92,125.73
!TX_BUSY  (via drill 0.81)
  Top 0.406: E22.10 178.94,138.43 181.48,138.43 184.02,135.89 v182.75,109.22 182.75,104.14 181.48,102.87 181.48,96.52 182.75,95.25 v182.75,81.28
  Bottom 0.406: E21.12 v182.75,109.22 | E16.1 v182.75,81.28
!TX_FLAG  (via drill 0.81)
  Top 0.406: v147.19,100.33 v147.19,92.71
  Bottom 0.406: E25.3 147.19,109.22 v147.19,100.33 | E17.5 E21.8 172.59,96.52 166.24,96.52 163.7,93.98 148.46,93.98 v147.19,92.71
!XMIT_ACTIVE  (via drill 0.81)
  Top 0.406: E15.8 205.61,39.37 205.61,57.15 v206.88,60.96
  Bottom 0.406: E6.11 232.28,72.39 232.28,66.04 228.47,62.23 219.58,62.23 218.31,60.96 v206.88,60.96
+3V  (via drill 0.81)
  Top 0.813: E9.3 E9.4 223.39,176.53 223.39,171.45 227.2,167.64 227.2,163.83 224.66,161.29 224.66,154.94 | E9.10 E9.11 | v63.37,82.55 63.37,104.14 65.91,106.68 65.91,113.03 | 65.91,113.03 E41.1 | 65.91,113.03 63.37,115.57 63.37,124.46 60.83,129.54 60.83,162.56 | v59.56,162.56 60.83,162.56 | v62.1,162.56 60.83,162.56 | E4.3 242.44,147.32 v242.44,154.94 | E8.3 229.74,147.32 229.74,151.13 v225.93,154.94 224.66,154.94 | 224.66,154.94 v223.39,154.94 | v168.78,168.91 172.59,163.83 v172.59,154.94 173.86,154.94 | 173.86,154.94 v175.13,154.94 | 173.86,154.94 173.86,115.57 172.59,113.03 172.59,110.49 E21.4 163.7,100.33 163.7,88.9 E20.1 167.51,78.74 167.51,55.88 170.05,53.34 E19.1 | E42.10 73.53,137.16 73.53,133.35 78.61,125.73 78.61,115.57 E41.13 | E15.10 203.07,41.91 203.07,48.26 v201.8,52.07 | v129.41,172.72 R1.1
  Bottom 0.813: R1.1 R2.2 | E5.3 247.52,181.61 248.79,182.88 248.79,187.96 247.52,189.23 243.71,189.23 242.44,187.96 242.44,180.34 241.17,179.07 E9.11 E9.4 | E51.1 E51.13 22.73,85.09 60.83,85.09 v63.37,82.55 E40.1 E40.13 | E41.13 E41.1 65.91,115.57 59.56,121.92 22.73,121.92 20.19,119.38 20.19,115.57 E52.13 E52.1 | E19.1 E19.13 181.48,46.99 E15.1 194.18,52.07 v201.8,52.07 | E7.10 E7.4 E12.10 210.69,107.95 | E21.4 172.59,110.49 172.59,115.57 175.13,118.11 196.72,118.11 197.99,116.84 E12.1 211.96,113.03 211.96,110.49 210.69,107.95 | E12.4 210.69,107.95 | E13.3 203.07,147.32 203.07,154.94 | v172.59,154.94 v175.13,154.94 203.07,154.94 | 203.07,154.94 v223.39,154.94 v225.93,154.94 v242.44,154.94 | v59.56,162.56 v62.1,162.56 67.18,163.83 79.88,163.83 81.15,167.64 92.58,167.64 100.2,173.99 120.52,173.99 121.79,172.72 v129.41,172.72 140.84,172.72 142.11,173.99 161.16,173.99 v168.78,168.91
+15V
  Top 0.813: D8.C R24.2 R23.1 R25.1 62.1,181.61 68.45,172.72 93.85,172.72 95.12,173.99 101.47,173.99 102.74,172.72 102.74,170.18 101.47,168.91 95.12,168.91 82.42,158.75 82.42,96.52 81.15,93.98 81.15,74.93 82.42,73.66 82.42,64.77 81.15,63.5 81.15,33.02 C15.+
  Bottom 0.813: U$1.DA2 58.29,7.62 58.29,17.78 59.56,19.05 C15.+
-15V  (via drill 0.81)
  Top 0.813: 4.1 27.81,184.15 30.35,185.42 36.7,198.12 43.05,204.47 92.58,204.47 R10.1 | v54.48,19.05 49.4,24.13 | 49.4,24.13 v46.86,21.59 | 49.4,24.13 41.78,31.75 C16.-
  Bottom 0.813: U$1.DB2 54.48,8.89 v54.48,19.05 | v46.86,21.59 40.51,21.59 37.97,19.05 31.62,19.05 20.19,26.67 7.49,26.67 3.68,29.21 3.68,128.27 11.3,134.62 27.81,134.62 32.89,138.43 32.89,160.02 43.05,167.64 50.67,167.64 62.1,177.8 82.42,177.8 93.85,186.69 97.66,186.69 100.2,189.23 97.66,195.58 R10.1
BTP3  (via drill 0.81)
  Top 0.406: E27.3 125.6,44.45 v125.6,52.07 | v143.38,154.94 140.84,151.13 140.84,144.78 | 140.84,144.78 E30.12 | 140.84,144.78 v140.84,110.49 140.84,102.87 139.57,101.6 139.57,88.9 v142.11,86.36 138.3,81.28 138.3,53.34 v139.57,50.8
  Bottom 0.406: E29.12 v140.84,110.49 | E32.11 112.9,76.2 112.9,81.28 116.71,83.82 124.33,83.82 126.87,86.36 v142.11,86.36 | E22.1 170.05,152.4 166.24,154.94 v143.38,154.94 | v125.6,52.07 137.03,52.07 v139.57,50.8
CLEAR_RX_FLAG  (via drill 0.81)
  Top 0.406: E42.13 78.61,149.86 78.61,160.02 v74.8,167.64 | v148.46,177.8 153.54,173.99 153.54,119.38 v154.81,118.11
  Bottom 0.406: v74.8,167.64 77.34,170.18 90.04,170.18 97.66,176.53 147.19,176.53 v148.46,177.8 | E25.13 154.81,115.57 v154.81,118.11
DOKCC  (via drill 0.81)
  Top 0.406: E31.2 E31.3 | E31.8 E31.9 | v120.52,43.18 119.25,44.45 119.25,71.12 124.33,76.2 124.33,102.87 119.25,106.68 119.25,138.43 v123.06,149.86
  Bottom 0.406: E31.9 112.9,36.83 112.9,40.64 111.63,41.91 E31.3 | E31.2 115.44,49.53 117.98,49.53 121.79,45.72 v120.52,43.18 | E30.13 133.22,147.32 | 133.22,147.32 E30.3 | 133.22,147.32 131.95,152.4 125.6,152.4 v123.06,149.86
DOTCF
  Bottom 0.406: E29.13 E29.3
DOTPC  (via drill 0.81)
  Top 0.406: E32.12 119.25,77.47 119.25,100.33 v121.79,102.87
  Bottom 0.406: E29.6 v121.79,102.87
ENABLE  (via drill 0.81)
  Top 0.406: v41.78,111.76 35.43,137.16 35.43,140.97 44.32,147.32 v44.32,160.02 | v65.91,144.78 65.91,160.02 v69.72,167.64 | v194.18,161.29 v196.72,161.29 197.99,157.48 205.61,149.86 205.61,95.25 206.88,92.71 206.88,85.09 v204.34,83.82 v204.34,81.28
  Bottom 0.406: E45.2 v41.78,111.76 | E42.5 65.91,142.24 v65.91,144.78 | E16.4 180.21,69.85 180.21,66.04 181.48,64.77 196.72,64.77 199.26,67.31 199.26,78.74 v204.34,81.28 v204.34,83.82 | v44.32,160.02 48.13,162.56 57.02,162.56 59.56,165.1 64.64,165.1 v69.72,167.64 73.53,171.45 90.04,171.45 97.66,177.8 144.65,177.8 147.19,180.34 148.46,180.34 152.27,176.53 162.43,176.53 189.1,161.29 v194.18,161.29 v196.72,161.29
FREQ_DIV  (via drill 0.81)
  Top 0.406: E37.13 E37.12 | E37.10 E37.9 | v166.24,99.06 166.24,90.17 171.32,83.82 171.32,69.85 E20.6
  Bottom 0.406: E20.6 173.86,72.39 173.86,82.55 175.13,83.82 189.1,83.82 190.37,82.55 190.37,81.28 E16.2 | E37.10 97.66,105.41 98.93,106.68 98.93,109.22 97.66,110.49 E37.12 | E37.9 97.66,102.87 107.82,97.79 147.19,97.79 149.73,96.52 163.7,96.52 v166.24,99.06
GND  (via drill 0.81)
  Top 0.813: C5.2 V5.2 | V5.2 V5.1 | V5.2 160.53,190.5 149.1,190.5 148.46,187.96 | D7.A D6.A C9.2 | U$1.DT1 10.03,8.89 v10.03,17.78 v10.03,20.32 E50.7 11.3,34.29 11.3,57.15 | E47.1 27.81,57.15 | 27.81,57.15 C65.2 | 27.81,57.15 E48.7 30.35,68.58 30.35,90.17 C66.2 29.08,99.06 E49.7 30.35,102.87 30.35,124.46 C67.2 | U$1.DN1 22.73,8.89 v22.73,17.78 v20.19,17.78 | v49.4,19.05 v51.94,19.05 51.94,8.89 U$1.DC1 | U$1.DF1 41.78,8.89 C16.+ | U$1.CT1 79.88,8.89 v79.88,19.05 v77.34,19.05 | U$1.CN1 92.58,8.89 v92.58,19.05 v95.12,19.05 | U$1.CF1 111.63,8.89 v111.63,17.78 109.09,21.59 E31.7 111.63,34.29 111.63,55.88 C49.2 109.09,58.42 E32.7 111.63,69.85 111.63,81.28 110.36,82.55 C50.2 109.09,93.98 E33.7 | U$1.CC1 121.79,8.89 121.79,13.97 v119.25,17.78 v119.25,24.13 | U$1.BT1 143.38,8.89 143.38,16.51 v145.92,19.05 v145.92,21.59 | U$1.BN1 156.08,8.89 156.08,19.05 v157.35,19.05 v154.81,19.05 | U$1.BF1 175.13,8.89 v176.4,19.05 v173.86,19.05 E19.7 172.59,34.29 172.59,54.61 C37.2 E20.7 172.59,68.58 172.59,85.09 C38.2 E21.7 | U$1.BC1 185.29,8.89 v185.29,19.05 | v185.29,19.05 v182.75,19.05 | U$1.AT1 213.23,8.89 v213.23,19.05 v210.69,19.05 | U$1.AN1 225.93,8.89 v225.93,19.05 | v225.93,19.05 v228.47,19.05 | U$1.AF2 244.98,8.89 v244.98,19.05 v247.52,19.05 | E9.7 228.47,173.99 228.47,194.31 C28.2 | C33.2 210.69,194.31 210.69,173.99 E14.7 206.42,167.46 | E43.1 48.13,55.88 C61.2 49.4,64.77 E44.7 50.67,68.58 50.67,81.28 49.4,82.55 C62.2 49.4,99.06 E45.7 50.67,102.87 50.67,124.46 C63.2 48.13,127 E46.7 50.67,137.16 50.67,156.21 C64.2 | E51.7 11.3,66.04 | 11.3,66.04 11.3,57.15 | C68.2 11.3,57.15 | 11.3,66.04 11.3,90.17 C69.2 10.03,99.06 E52.7 11.3,102.87 C70.2
  Top 0.813: E35.1 90.04,49.53 C53.2 90.04,64.77 E36.7 91.31,69.85 91.31,90.17 C54.2 90.04,99.06 E37.7 86.23,102.87 86.23,120.65 C55.2 90.04,130.81 E38.8 91.31,134.62 91.31,158.75 C56.2 | E39.7 70.99,35.56 70.99,54.61 C57.2 69.72,64.77 E40.7 70.99,68.58 70.99,88.9 C58.2 68.45,91.44 E41.7 | C51.2 109.09,127 E34.8 111.63,134.62 111.63,153.67 C52.2 | C39.2 170.05,128.27 E22.7 172.59,137.16 172.59,151.13 168.78,154.94 168.78,158.75 C40.2 | C59.2 70.99,127 70.99,134.62 | 70.99,134.62 E42.7 | E42.2 70.99,147.32 | 70.99,147.32 70.99,134.62 | C60.2 70.99,158.75 70.99,147.32 | E23.1 C41.2 151,62.23 152.27,64.77 152.27,78.74 E24.1 149.73,90.17 C42.2 151,99.06 E25.7 152.27,101.6 152.27,116.84 151,119.38 C43.2 E26.7 152.27,137.16 152.27,158.75 C44.2 | v185.29,19.05 C71.2 E15.7 190.37,35.56 C34.2 189.1,58.42 189.1,64.77 E16.7 190.37,68.58 190.37,88.9 C35.2 189.1,99.06 E17.7 190.37,102.87 C36.2 190.37,127 190.37,132.08 E18.7 | v225.93,19.05 222.12,25.4 213.23,25.4 210.69,27.94 210.69,39.37 | 210.69,39.37 E10.4 | C20.2 248.79,30.48 E1.7 250.06,35.56 250.06,43.18 E1.2 250.06,48.26 250.06,58.42 C21.2 E2.7 251.33,71.12 251.33,88.9 C22.2 247.52,100.33 E3.7 250.06,105.41 250.06,123.19 C23.2 | R27.1 D10.A E6.7 229.74,69.85 229.74,87.63 C25.2 225.93,100.33 E7.7 231.01,105.41 231.01,121.92 C26.2 | R16.1 R19.1 | E4.10 251.33,142.24 251.33,158.75 C24.2 251.33,161.29 251.33,173.99 E5.10 | 206.42,167.46 v205.61,160.02 | D1.C 200.53,168.91 206.42,167.46 | E8.10 237.36,140.97 237.36,153.67 C27.2 | C48.2 131.95,158.75 131.95,137.16 E30.7 129.41,127 C47.2 131.95,121.92 131.95,102.87 E29.7 130.68,99.06 C46.2 130.68,83.82 E28.1 131.95,80.01 131.95,58.42 C45.2 130.68,49.53 E27.1 131.95,45.72 131.95,40.64 E27.5
  Top 0.813: T1.4 184.02,179.07 180.21,182.88 178.94,182.88 | 178.94,182.88 176.4,180.34 166.24,180.34 V5.1 | V5.1 v154.81,182.88 148.46,187.96 | 148.46,187.96 C2.2 | C2.2 Y1.2 | C1.- 178.94,182.88 | E13.10 213.23,142.24 213.23,158.75 C32.2 | C8.- D3.A 107.82,201.93 126.87,201.93 131.95,194.31 142.11,194.31 C2.2 | C31.2 210.69,124.46 210.69,104.14 E12.7 C30.2 210.69,90.17 210.69,69.85 E11.7 209.42,64.77 C29.2 E10.1 210.69,44.45 210.69,39.37
  ECO2 0.813: E10.4 204.34,35.56 204.34,22.86 206.88,20.32 v210.69,19.05
  Bottom 0.813: 22.73,157.48 0.1 27.81,157.48 30.35,160.02 34.16,167.64 39.24,171.45 Q3.1 50.67,175.26 53.21,177.8 62.1,182.88 C9.2 | 22.73,157.48 22.73,186.69 24,187.96 GND.1 | U$1.DT1 10.03,8.89 v10.03,17.78 | v10.03,17.78 v10.03,20.32 2.41,24.13 2.41,130.81 17.65,143.51 22.73,149.86 22.73,157.48 | U$1.DN1 22.73,8.89 v22.73,17.78 | v22.73,17.78 v20.19,17.78 v10.03,17.78 | U$1.DF1 41.78,8.89 41.78,17.78 | 41.78,17.78 C16.+ v49.4,19.05 v51.94,19.05 | 41.78,17.78 v22.73,17.78 | U$1.DC1 51.94,8.89 v51.94,19.05 | U$1.CT1 79.88,8.89 v79.88,19.05 | v79.88,19.05 v77.34,19.05 70.99,21.59 60.83,21.59 59.56,20.32 53.21,20.32 v51.94,19.05 | U$1.CN1 92.58,8.89 v92.58,19.05 | v92.58,19.05 v79.88,19.05 | U$1.CF1 111.63,8.89 v111.63,17.78 | v111.63,17.78 106.55,21.59 101.47,21.59 v95.12,19.05 v92.58,19.05 | U$1.CC1 121.79,8.89 121.79,13.97 v119.25,17.78 v111.63,17.78 | U$1.BT1 143.38,8.89 143.38,13.97 v145.92,19.05 | v145.92,19.05 v145.92,21.59 140.84,24.13 v119.25,24.13 | U$1.BN1 156.08,8.89 156.08,19.05 v157.35,19.05 | v157.35,19.05 v154.81,19.05 | v145.92,19.05 v157.35,19.05 | U$1.BC1 185.29,8.89 v185.29,19.05 | v185.29,19.05 v182.75,19.05 v176.4,19.05 | v176.4,19.05 v173.86,19.05 v157.35,19.05 | U$1.BF1 175.13,8.89 175.13,19.05 v176.4,19.05 | U$1.AT1 213.23,8.89 v213.23,19.05 | v213.23,19.05 v210.69,19.05 208.15,21.59 190.37,21.59 v185.29,19.05 | U$1.AN1 225.93,8.89 v225.93,19.05 | v225.93,19.05 v213.23,19.05 | U$1.AF2 244.98,8.89 v244.98,19.05 | v244.98,19.05 242.44,16.51 238.63,16.51 236.09,19.05 | 236.09,19.05 v228.47,19.05 v225.93,19.05 | U$1.AC2 255.14,8.89 255.14,13.97 250.06,19.05 v247.52,19.05 v244.98,19.05
  Bottom 0.813: R2.1 111.63,194.31 106.55,194.31 105.28,196.85 D3.A | C33.2 211.96,198.12 224.66,198.12 C28.2 | D1.C 197.99,168.91 194.18,166.37 191.64,166.37 189.1,168.91 | T1.8 189.1,168.91 | 189.1,168.91 189.1,177.8 187.83,179.07 T1.4 | E39.7 64.64,34.29 C15.- | C69.2 12.57,93.98 26.54,93.98 C66.2 31.62,93.98 36.7,93.98 C62.2 51.94,92.71 65.91,92.71 C58.2 | E42.2 63.37,147.32 E46.12 | R12.1 192.91,132.08 E18.7 | C19.- E27.5 E27.10 | C64.2 51.94,157.48 69.72,157.48 | 69.72,157.48 C60.2 | C40.2 170.05,157.48 | 170.05,157.48 151,157.48 | 151,157.48 130.68,157.48 | 130.68,157.48 110.36,157.48 | 110.36,157.48 90.04,157.48 | 90.04,157.48 69.72,157.48 | C56.2 90.04,157.48 | C52.2 110.36,157.48 | C48.2 130.68,157.48 | C44.2 151,157.48 | C24.2 250.06,157.48 232.28,157.48 | 232.28,157.48 214.5,157.48 | 214.5,157.48 205.61,157.48 | 205.61,157.48 170.05,157.48 | C32.2 214.5,157.48 | C27.2 232.28,157.48 | E10.10 211.96,40.64 211.96,45.72 E10.1 | E1.7 251.33,35.56 251.33,40.64 E1.12 | C20.2 244.98,25.4 238.63,22.86 236.09,19.05 | C17.- E1.2 | R19.1 228.47,49.53 229.74,48.26 232.28,48.26 233.55,49.53 R27.1 | C29.2 211.96,54.61 217.04,54.61 219.58,57.15 228.47,57.15 231.01,59.69 D10.A | E11.7 201.8,69.85 C18.- | v205.61,160.02 205.61,157.48
INIT  (via drill 0.81)
  Top 0.406: U$1.CR1 86.23,10.16 87.5,20.32 92.58,24.13 v93.85,26.67
  Bottom 0.406: E27.9 130.68,29.21 119.25,29.21 115.44,27.94 109.09,27.94 106.55,26.67 v93.85,26.67
INITIALIZE  (via drill 0.81)
  Top 0.406: E5.2 244.98,182.88 244.98,160.02 246.25,156.21 246.25,153.67 244.98,152.4 244.98,148.59 E4.2 | v222.12,73.66 v222.12,76.2 223.39,77.47 223.39,82.55 220.85,85.09 220.85,105.41 222.12,106.68 v222.12,120.65 224.66,123.19 224.66,146.05 E8.2 | E11.5 E11.4 206.88,76.2 206.88,78.74 E11.2 E11.1 | v161.16,50.8 162.43,53.34 162.43,71.12 159.89,73.66 159.89,81.28 158.62,82.55 158.62,97.79
  ECO2 0.406: v161.16,50.8 162.43,49.53 203.07,49.53 215.77,54.61 220.85,64.77 v222.12,73.66
  Bottom 0.406: E13.2 205.61,148.59 205.61,151.13 206.88,152.4 223.39,152.4 | 223.39,152.4 223.39,149.86 E8.2 | E4.2 237.36,152.4 223.39,152.4 | E11.5 215.77,64.77 217.04,64.77 222.12,68.58 v222.12,73.66 v222.12,76.2 | v222.12,120.65 219.58,120.65 217.04,123.19 205.61,123.19 204.34,124.46 199.26,124.46 195.45,120.65 173.86,120.65 163.7,114.3 163.7,106.68 159.89,102.87 | E27.14 144.65,46.99 148.46,50.8 v161.16,50.8
INT_ENA  (via drill 0.81)
  Top 0.406: U$1.CB1 124.33,8.89 124.33,15.24 121.79,17.78 121.79,20.32 123.06,21.59 123.06,33.02 117.98,39.37 117.98,72.39 120.52,74.93 120.52,97.79 v121.79,100.33
  Bottom 0.406: E33.6 111.63,102.87 115.44,99.06 120.52,99.06 v121.79,100.33 124.33,99.06 148.46,99.06 151,97.79 161.16,97.79 164.97,101.6 E21.6
IO_PAUSE  (via drill 0.81)
  Top 0.406: E10.6 v201.8,34.29 v201.8,31.75 | E35.6 E35.5 | E35.10 E35.11 | E28.5 126.87,68.58 126.87,52.07 127.08,45.87 E27.2 | E23.5 E23.6 | E23.11 E23.10 | v162.43,39.37 164.97,40.64 164.97,72.39 162.43,74.93 v162.43,85.09
  Bottom 0.406: E35.5 E35.10 | E35.11 101.47,43.18 101.47,45.72 109.09,52.07 121.79,52.07 123.06,50.8 124.33,50.8 128.14,45.72 E27.2 131.95,44.45 135.76,39.37 E27.11 143.38,39.37 E23.5 E23.10 163.7,34.29 163.7,29.21 168.78,25.4 196.72,25.4 v201.8,31.75 v201.8,34.29 | E23.11 v162.43,39.37 | E24.12 159.89,78.74 159.89,81.28 v162.43,85.09
LAST_UNIT  (via drill 0.81)
  Top 0.406: E12.9 218.31,104.14 218.31,106.68 219.58,107.95 219.58,121.92 220.85,123.19 v220.85,125.73
  Bottom 0.406: E3.13 252.6,114.3 251.33,115.57 251.33,118.11 250.06,119.38 243.71,119.38 241.17,121.92 233.55,121.92 229.74,128.27 223.39,128.27 v220.85,125.73
N$1  (via drill 0.81)
  Top 0.406: E25.11 162.43,111.76 v162.43,129.54
  Bottom 0.406: E30.8 152.27,129.54 v162.43,129.54
N$2
  Top 0.406: E47.13 41.78,48.26 41.78,64.77 39.24,67.31 39.24,74.93 37.97,76.2 37.97,104.14 E49.10
N$3
  Top 0.406: E47.14 36.7,48.26 36.7,69.85 E48.10
N$4
  Top 0.406: E47.2 25.27,46.99 25.27,71.12 E48.4
N$5
  Top 0.406: E47.3 24,45.72 24,105.41 E49.4
N$6  (via drill 0.81)
  Top 0.406: v41.78,68.58 41.78,72.39 43.05,73.66 43.05,77.47 40.51,78.74 40.51,106.68 E49.12
  Bottom 0.406: E48.9 v41.78,68.58
N$7  (via drill 0.81)
  Top 0.406: v142.11,100.33 142.11,106.68 143.38,107.95 143.38,111.76 142.11,113.03 142.11,119.38 v143.38,121.92 | E22.5 167.51,137.16 167.51,124.46 v168.78,123.19
  Bottom 0.406: E29.8 v142.11,100.33 | v143.38,121.92 166.24,121.92 v168.78,123.19
N$8
  Top 0.406: V4.1 V4.2 C4.2 | R4.2 C6.1
  Bottom 0.406: C6.1 144.65,193.04 159.89,193.04 163.7,190.5 171.32,190.5 V4.2 | Q1.1 131.95,186.69 134.49,186.69 R4.2 | C5.1 166.24,201.93 175.13,201.93 176.4,200.66 176.4,195.58 V4.2 | V4.2 C4.2
N$9
  Top 0.406: E43.13 59.56,45.72 59.56,60.96 62.1,62.23 62.1,66.04 59.56,68.58 59.56,71.12 58.29,72.39 58.29,74.93 57.02,76.2 57.02,104.14 E45.10
N$10
  Top 0.406: E43.14 57.02,48.26 57.02,69.85 E44.10
N$11
  Top 0.406: E43.3 44.32,45.72 44.32,72.39 45.59,73.66 45.59,77.47 44.32,78.74 44.32,93.98 45.59,95.25 45.59,97.79 44.32,99.06 44.32,105.41 E45.4
N$12
  Top 0.406: E43.2 45.59,45.72 45.59,71.12 E44.4
N$13
  Top 0.406: E45.5 45.59,104.14 45.59,99.06 46.86,97.79 46.86,80.01 E44.2
N$14  (via drill 0.81)
  Top 0.406: E44.12 57.02,74.93 57.02,71.12 58.29,69.85 58.29,66.04 v59.56,64.77
  Bottom 0.406: E44.5 50.67,71.12 53.21,68.58 53.21,64.77 54.48,63.5 58.29,63.5 v59.56,64.77
N$15  (via drill 0.81)
  Top 0.406: v62.1,71.12 60.83,72.39 60.83,74.93 58.29,77.47 58.29,107.95 E45.12
  Bottom 0.406: E44.9 v62.1,71.12
N$16
  Bottom 0.406: E49.2 26.54,114.3 26.54,116.84 27.81,118.11 55.75,118.11 58.29,115.57 58.29,104.14 57.02,102.87 E45.9
N$17
  Top 0.406: E49.5 25.27,104.14 25.27,81.28 E48.2
N$18  (via drill 0.81)
  Top 0.406: E48.12 37.97,73.66 37.97,64.77 v39.24,63.5
  Bottom 0.406: E48.5 30.35,71.12 34.16,63.5 v39.24,63.5
N$19
  Top 0.406: 7.1 29.08,175.26 32.89,180.34 35.43,186.69 39.24,194.31 45.59,201.93 82.42,201.93 88.77,194.31 C7.1 93.85,189.23
  ECO1 0.406: R30.1 C7.1
N$20
  Bottom 0.406: E48.8 41.78,66.04 48.13,60.96 78.61,60.96 84.96,64.77 84.96,69.85 E36.5
N$21
  Bottom 0.406: E48.6 30.35,68.58 34.16,59.69 79.88,59.69 86.23,63.5 86.23,67.31 E36.6
N$22  (via drill 0.81)
  Top 0.406: E36.2 84.96,80.01 v84.96,91.44
  Bottom 0.406: E49.6 31.62,101.6 34.16,97.79 40.51,95.25 78.61,95.25 v84.96,91.44
N$23  (via drill 0.81)
  Top 0.406: v97.66,97.79 98.93,96.52 98.93,77.47 E36.12
  Bottom 0.406: E45.8 57.02,99.06 87.5,99.06 90.04,97.79 v97.66,97.79
N$24
  Bottom 0.406: E44.8 58.29,67.31 62.1,67.31 68.45,63.5 76.07,63.5 82.42,67.31 82.42,72.39 E36.3
N$25
  Bottom 0.406: E44.6 50.67,68.58 51.94,67.31 51.94,64.77 54.48,62.23 77.34,62.23 83.69,66.04 83.69,71.12 E36.4
N$26  (via drill 0.81)
  Top 0.406: E36.1 87.5,82.55 v87.5,96.52
  Bottom 0.406: E45.6 50.67,102.87 55.75,97.79 82.42,97.79 v87.5,96.52
N$28  (via drill 0.81)
  Top 0.406: v43.05,96.52 43.05,106.68 44.32,107.95 44.32,144.78 E46.2
  Bottom 0.406: E49.9 39.24,101.6 v43.05,96.52
N$31  (via drill 0.81)
  Top 0.406: U$1.DB1 54.48,8.89 54.48,15.24 57.02,17.78 57.02,20.32 50.67,25.4 50.67,53.34 51.94,54.61 v51.94,132.08
  Bottom 0.406: R22.1 R21.1 E46.5 51.94,137.16 v51.94,132.08
N$32  (via drill 0.81)
  Top 0.406: E22.11 180.21,143.51 180.21,156.21 178.94,157.48 178.94,160.02 180.21,161.29 182.75,161.29 v184.02,160.02 | v112.9,86.36 112.9,148.59 114.17,151.13 114.17,153.67 112.9,158.75 112.9,161.29 v117.98,171.45
  Bottom 0.406: E36.8 91.31,69.85 91.31,83.82 93.85,86.36 97.66,86.36 100.2,88.9 106.55,88.9 109.09,87.63 v112.9,86.36 | v117.98,171.45 140.84,171.45 143.38,172.72 159.89,172.72 167.51,166.37 175.13,166.37 184.02,161.29 v184.02,160.02
N$33  (via drill 0.81)
  Top 0.406: E35.2 86.23,46.99 86.23,48.26 87.5,50.8 87.5,53.34 86.23,55.88 v86.23,60.96
  Bottom 0.406: E24.11 164.97,69.85 164.97,59.69 159.89,54.61 156.08,54.61 151,59.69 147.19,59.69 144.65,62.23 102.74,62.23 101.47,63.5 97.66,63.5 95.12,60.96 v86.23,60.96
N$34
  Top 0.406: E24.6 147.19,66.04 147.19,45.72 E23.2
N$35  (via drill 0.81)
  Top 0.406: E23.3 152.27,44.45 152.27,55.88 v156.08,63.5
  Bottom 0.406: E28.10 142.11,76.2 144.65,76.2 147.19,73.66 147.19,66.04 149.73,63.5 v156.08,63.5
N$36
  Top 0.406: E23.14 157.35,53.34 159.89,55.88 159.89,66.04 E24.9
  Bottom 0.406: E28.11 134.49,72.39 134.49,66.04 135.76,64.77 145.92,64.77 148.46,62.23 153.54,62.23 154.81,60.96 158.62,60.96 159.89,62.23 159.89,67.31 158.62,68.58 E24.9
N$37
  Top 0.406: E23.13 159.89,45.72 159.89,48.26 158.62,49.53 158.62,52.07 161.16,54.61 160.97,68.29 E24.10
  Bottom 0.406: E28.6 133.22,67.31 133.22,66.04 135.76,63.5 144.65,63.5 147.19,60.96 152.27,60.96 153.54,59.69 158.62,59.69 162.43,62.23 162.43,68.58 E24.10
N$38  (via drill 0.81)
  Top 0.406: v172.59,63.5 v172.59,59.69
  Bottom 0.406: E10.2 206.88,45.72 206.88,50.8 203.07,54.61 194.18,54.61 189.1,49.53 166.24,49.53 164.97,50.8 164.97,52.07 166.24,53.34 171.32,54.61 172.59,55.88 v172.59,59.69 | E28.12 138.3,77.47 145.92,77.47 E24.4 153.54,76.2 153.54,82.55 154.81,83.82 157.35,83.82 162.43,87.63 163.7,87.63 164.97,86.36 164.97,83.82 161.16,80.01 161.16,74.93 166.24,71.12 166.24,66.04 168.78,63.5 v172.59,63.5
N$39  (via drill 0.81)
  Top 0.406: v144.65,144.78 v144.65,142.24 143.38,140.97 143.38,124.46 144.65,121.92 v144.65,116.84 | E33.9 E33.8
  Bottom 0.406: E33.9 125.6,110.49 125.6,115.57 129.41,118.11 138.3,118.11 139.57,116.84 v144.65,116.84 | E26.4 v144.65,142.24 v144.65,144.78
N$40  (via drill 0.81)
  Top 0.406: E35.14 100.2,57.15 102.74,58.42 102.74,81.28 105.28,83.82 105.28,86.36 104.01,87.63 104.01,114.3 106.55,116.84 106.55,146.05 v104.01,148.59
  Bottom 0.406: E38.15 v104.01,148.59 106.55,152.4 106.55,154.94 111.63,154.94 114.17,152.4 114.17,149.86 E34.15
N$41  (via drill 0.81)
  Top 0.406: E35.13 95.12,45.72 95.12,49.53 97.66,57.15 101.47,59.69 101.47,81.28 104.01,83.82 104.01,86.36 102.74,87.63 102.74,115.57 105.28,118.11 v105.28,144.78
  Bottom 0.406: E38.14 v105.28,144.78 105.28,147.32 107.82,151.13 109.09,152.4 110.36,152.4 111.63,151.13 111.63,148.59 E34.14
N$42  (via drill 0.81)
  Top 0.406: E35.3 84.96,44.45 84.96,49.53 86.23,52.07 86.23,53.34 84.96,55.88 84.96,77.47 82.42,80.01 82.42,92.71 83.69,93.98 83.69,147.32 86.23,149.86 E38.1 | E34.1 105.28,149.86 v104.01,152.4
  Bottom 0.406: E38.1 91.31,152.4 v104.01,152.4
N$43
  Top 0.406: E33.12 E33.11
  Bottom 0.406: E33.12 128.14,119.38 139.57,119.38 140.84,118.11 147.19,118.11 E25.1